# EAGLE design interface_board (EAGLE 7.5.0)

## Sheet 1 of 3
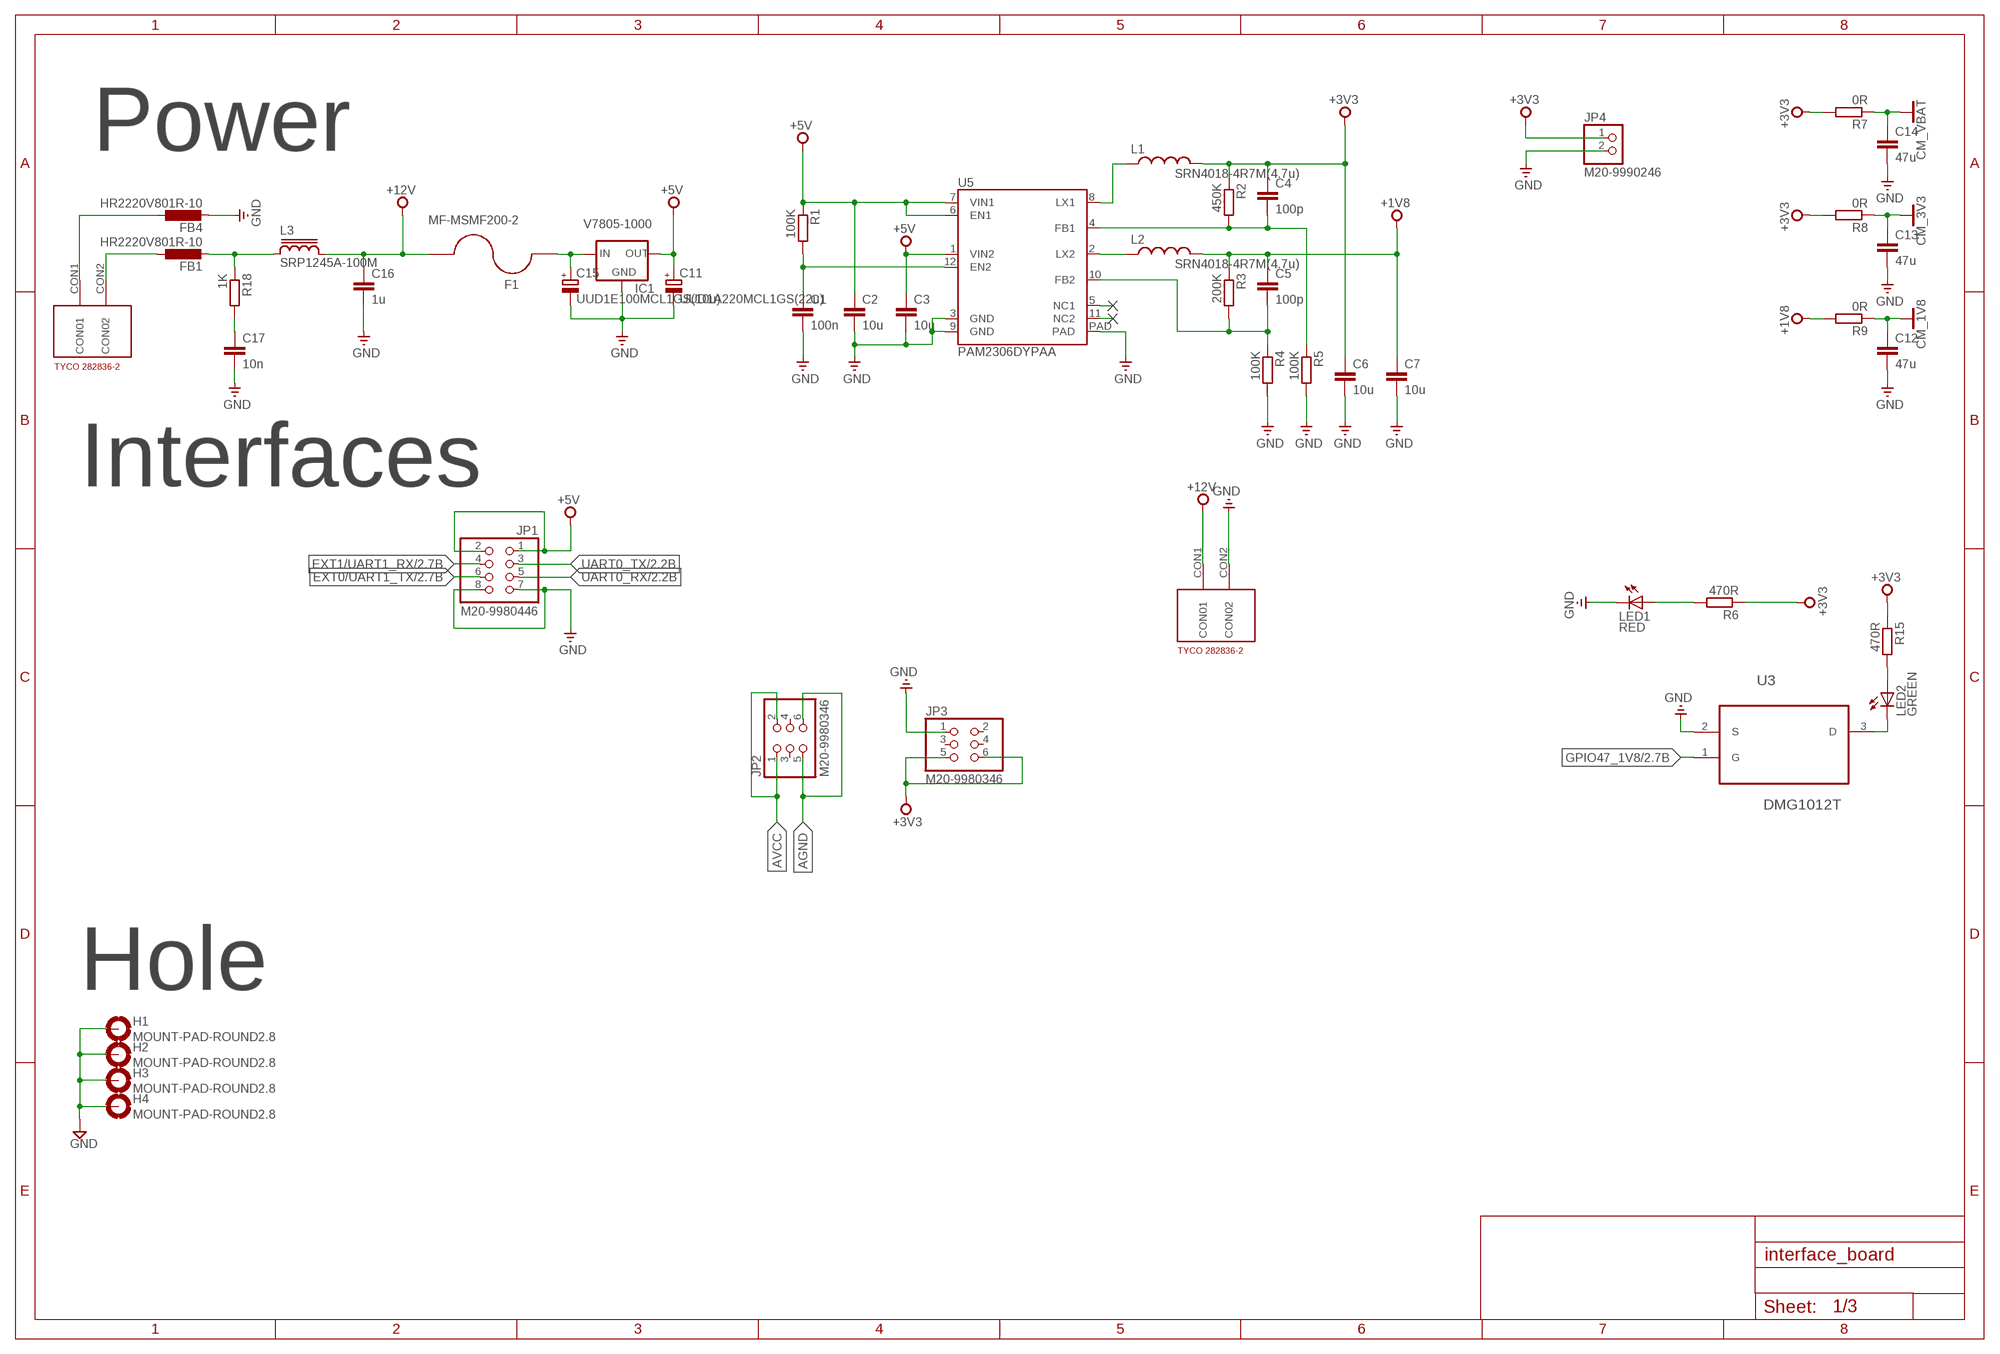
[diagram p0: schematic, sheet 1]

### Parts
C1  100n  C-EUC0402  [C0402]
C2  10u  C-EUC0805  [C0805]
C3  10u  C-EUC0805  [C0805]
C4  100p  C-EUC0402  [C0402]
C5  100p  C-EUC0402  [C0402]
C6  10u  C-EUC0805  [C0805]
C7  10u  C-EUC0805  [C0805]
C11  UUD1A220MCL1GS(22u)  CPOL-EU153CLV-0405  [153CLV-0405]
C12  47u  C-EUC1206  [C1206]
C13  47u  C-EUC1206  [C1206]
C14  47u  C-EUC1206  [C1206]
C15  UUD1E100MCL1GS(10u)  CPOL-EU153CLV-0405  [153CLV-0405]
C16  1u  C-EUC0402  [C0402]
C17  10n  C-EUC0402  [C0402]
F1  MF-MSMF200-2  MF-MSMF075/24  [1812]
FB1  HR2220V801R-10  L-EUL5650M  [L5650M]
FB4  HR2220V801R-10  L-EUL5650M  [L5650M]
H1  MOUNT-PAD-ROUND2.8  [2,8-PAD]
H2  MOUNT-PAD-ROUND2.8  [2,8-PAD]
H3  MOUNT-PAD-ROUND2.8  [2,8-PAD]
H4  MOUNT-PAD-ROUND2.8  [2,8-PAD]
IC1  V7805-1000  VR_1OUTXX  [DIP_3PIN]
JP1  M20-9980446  PINHD-2X4  [2X04]
JP2  M20-9980346  PINHD-2X3  [2X03]
JP3  M20-9980346  PINHD-2X3  [2X03]
JP4  M20-9990246  PINHD-1X2  [1X02]
L1  SRN4018-4R7M(4.7u)  BOURNS-SRN4018  [BOURNS-SRN4018]
L2  SRN4018-4R7M(4.7u)  BOURNS-SRN4018  [BOURNS-SRN4018]
L3  SRP1245A-100M  SRP1250A  [SRP1250A]
LED1  RED  LEDCHIP-LED0603  [CHIP-LED0603]
LED2  GREEN  LEDCHIP-LED0603  [CHIP-LED0603]
R1  100K  R-EU_R0402  [R0402]
R2  450K  R-EU_R0402  [R0402]
R3  200K  R-EU_R0402  [R0402]
R4  100K  R-EU_R0402  [R0402]
R5  100K  R-EU_R0402  [R0402]
R6  470R  R-EU_R0402  [R0402]
R7  0R  R-EU_R0805  [R0805]
R8  0R  R-EU_R0805  [R0805]
R9  0R  R-EU_R0805  [R0805]
R15  470R  R-EU_R0402  [R0402]
R18  1K  R-EU_R0402  [R0402]
U3  DMG1012T  [SOT523]
U5  PAM2306DYPAA  PAM2306  [WDFN3X3-12L]
U$1  282836-2  [282836-2]
U$2  M20-9980346  282836-2  [282836-2]

### Nets
+1V8: C5.1 C7.1 L2.P$1 R3.1 R9.2
+3V3: C4.1 C6.1 JP3.5 JP3.6 JP4.1 L1.P$1 R2.1 R6.1 R7.2 R8.2 R15.1 ; also sheet 2,3
+5V [VCC]: C2.1 C3.1 C11.+ IC1.OUT JP1.1 JP1.2 R1.1 U5.1(VIN2) U5.6(EN1) U5.7(VIN1) ; also sheet 3
+12V [VCC]: C16.1 F1.1 L3.2 U$2.CON1(CON01)
AGND [GND]: FB4.1 JP2.5 JP2.6 U$1.CON1(CON01)
AVCC: FB1.1 JP2.1 JP2.2 U$1.CON2(CON02)
CM_1V8: C12.1 R9.1 ; also sheet 2
CM_3V3: C13.1 R8.1 ; also sheet 2
CM_VBAT: C14.1 R7.1 ; also sheet 2
EXT0/UART1_TX: JP1.6 ; also sheet 2
EXT1/UART1_RX: JP1.4 ; also sheet 2
GND [GND]: C1.2 C2.2 C3.2 C6.2 C7.2 C11.- C12.2 C13.2 C14.2 C15.- C16.2 C17.2 FB4.2 H1.B2,8(MOUNT) H2.B2,8(MOUNT) H3.B2,8(MOUNT) H4.B2,8(MOUNT) IC1.GND JP1.7 JP1.8 JP3.1 JP4.2 LED1.C R4.2 R5.2 U3.2(S) U5.3(GND) U5.9(GND) U5.PAD U$2.CON2(CON02) ; also sheet 2,3
GPIO47_1V8: U3.1(G) ; also sheet 2
N$1: C1.1 R1.2 U5.12(EN2)
N$2: L1.P$2 U5.8(LX1)
N$3: U5.5(NC1)
N$4: U5.11(NC2)
N$6 [VCC]: FB1.2 L3.1 R18.1
N$7: L2.P$2 U5.2(LX2)
N$8: C4.2 R2.2 R5.1 U5.4(FB1)
N$9: LED1.A R6.2
N$10: C5.2 R3.2 R4.1 U5.10(FB2)
N$32: LED2.A R15.2
N$33: LED2.C U3.3(D)
N$38: C17.1 R18.2
N$39: C15.+ F1.2 IC1.IN
UART0_RX: JP1.5 ; also sheet 2
UART0_TX: JP1.3 ; also sheet 2
Unconnected: JP2.3 JP2.4 JP3.2 JP3.3 JP3.4

### Notes on the sheet
- Power
- Interfaces
- Hole

## Sheet 2 of 3
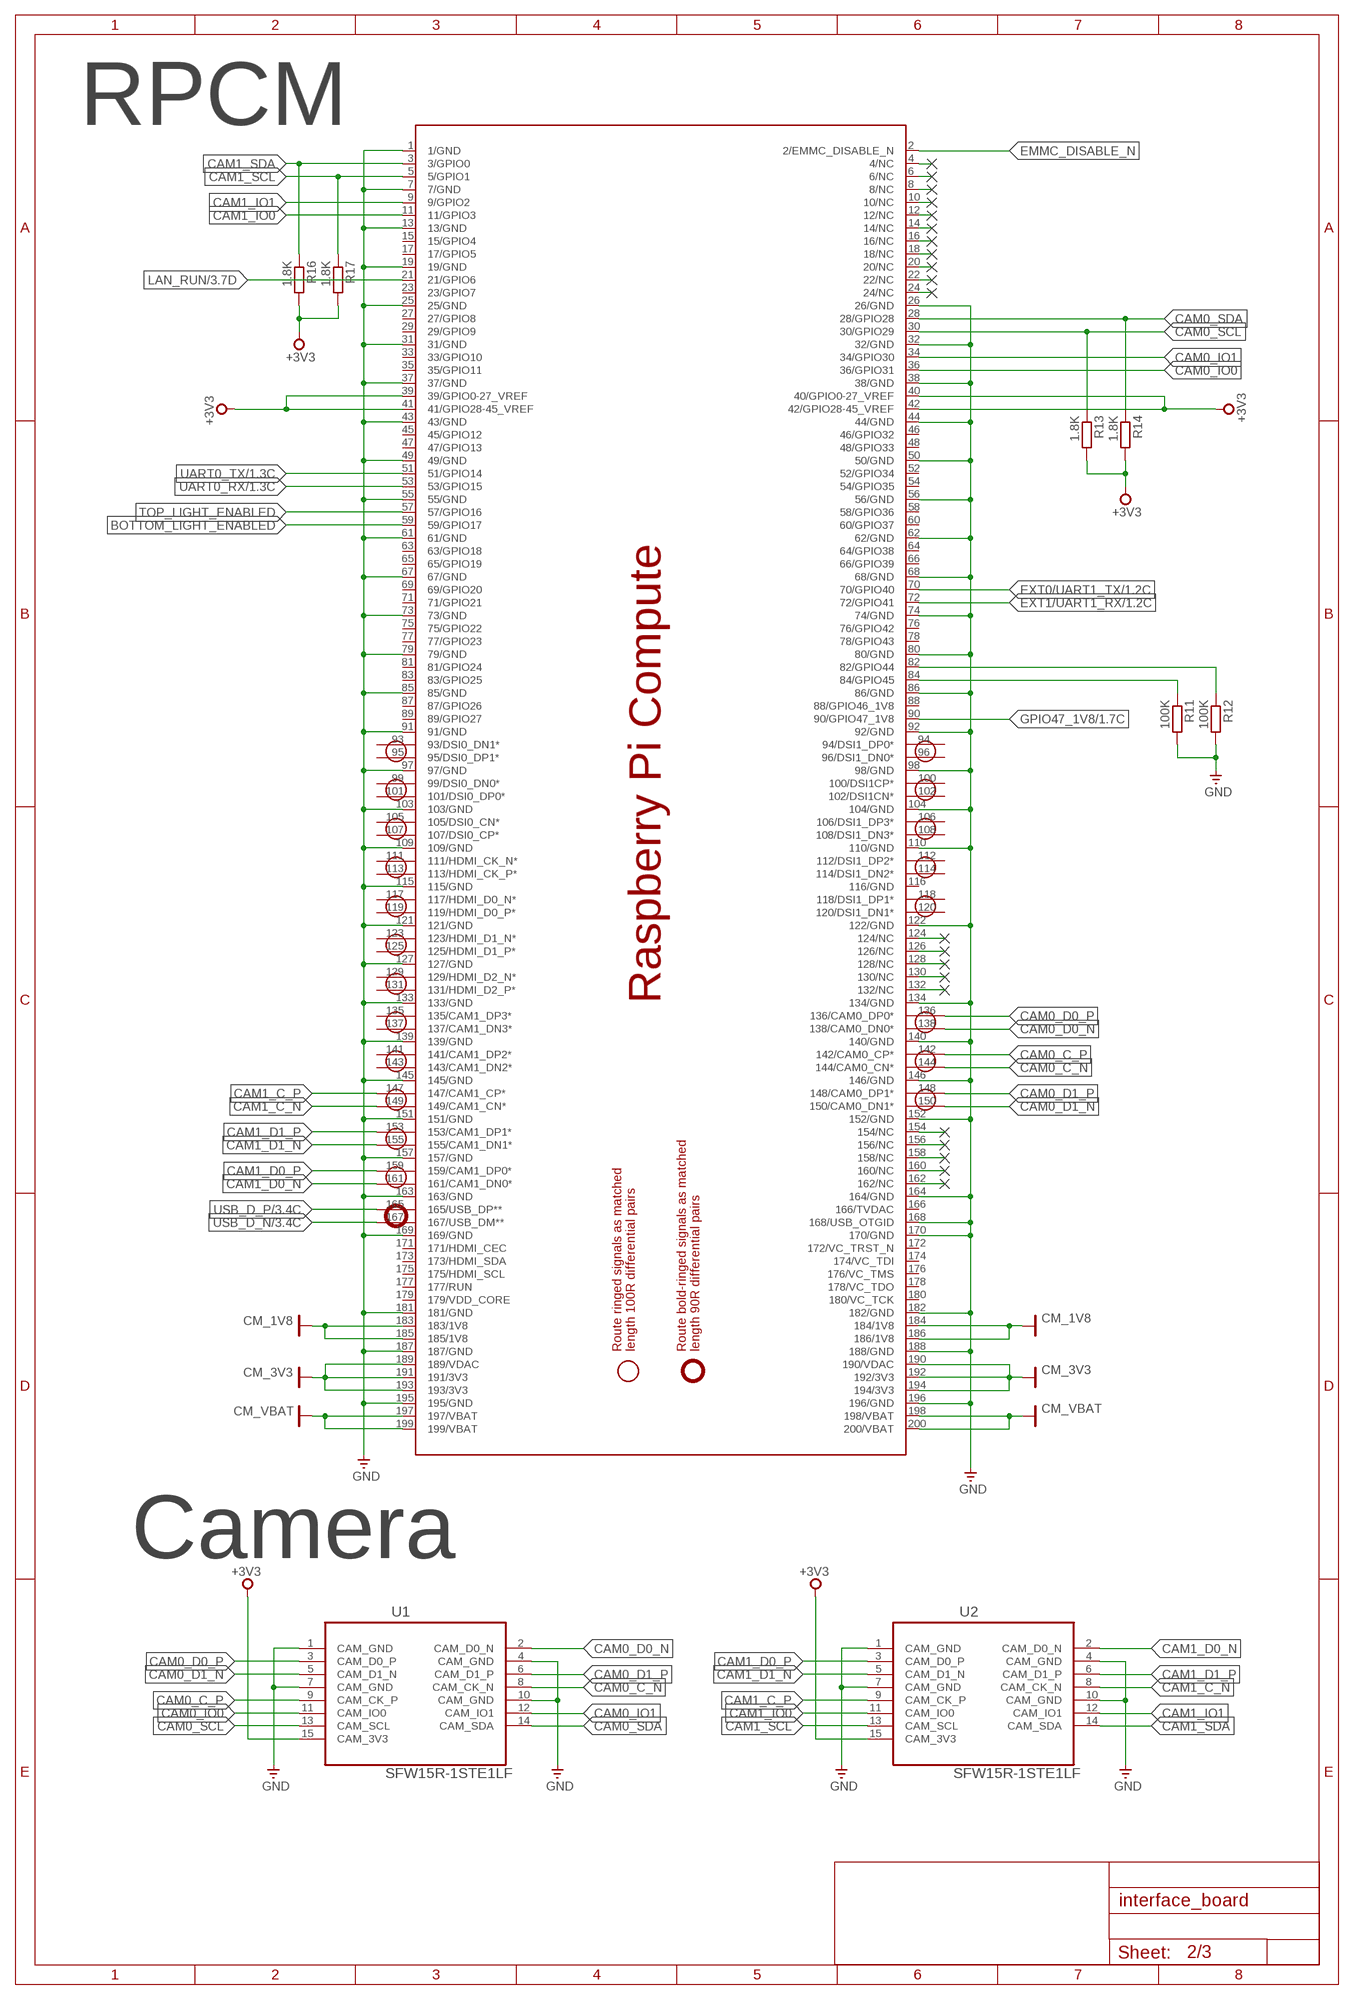
[diagram p1: schematic, sheet 2]

### Parts
PCB1  1473005-4  RPI_COMPUTE  [RPI_COMPUTE]
R11  100K  R-EU_R0402  [R0402]
R12  100K  R-EU_R0402  [R0402]
R13  1.8K  R-EU_R0402  [R0402]
R14  1.8K  R-EU_R0402  [R0402]
R16  1.8K  R-EU_R0402  [R0402]
R17  1.8K  R-EU_R0402  [R0402]
U1  SFW15R-1STE1LF  RPI_CAMERA  [RPI_CAMERA]
U2  SFW15R-1STE1LF  RPI_CAMERA  [RPI_CAMERA]

### Nets
+3V3: PCB1.39(39/GPIO0-27_VREF) PCB1.40(40/GPIO0-27_VREF) PCB1.41(41/GPIO28-45_VREF) PCB1.42(42/GPIO28-45_VREF) R13.2 R14.2 R16.2 R17.2 U1.15(CAM_3V3) U2.15(CAM_3V3) ; also sheet 1,3
BOTTOM_LIGHT_ENABLED: PCB1.59(59/GPIO17)
CAM0_C_N [100ohm_differencial_pair]: PCB1.144(144/CAM0_CN*) U1.8(CAM_CK_N)
CAM0_C_P [100ohm_differencial_pair]: PCB1.142(142/CAM0_CP*) U1.9(CAM_CK_P)
CAM0_D0_N [100ohm_differencial_pair]: PCB1.138(138/CAM0_DN0*) U1.2(CAM_D0_N)
CAM0_D0_P [100ohm_differencial_pair]: PCB1.136(136/CAM0_DP0*) U1.3(CAM_D0_P)
CAM0_D1_N [100ohm_differencial_pair]: PCB1.150(150/CAM0_DN1*) U1.5(CAM_D1_N)
CAM0_D1_P [100ohm_differencial_pair]: PCB1.148(148/CAM0_DP1*) U1.6(CAM_D1_P)
CAM0_IO0: PCB1.36(36/GPIO31) U1.11(CAM_IO0)
CAM0_IO1: PCB1.34(34/GPIO30) U1.12(CAM_IO1)
CAM0_SCL: PCB1.30(30/GPIO29) R13.1 U1.13(CAM_SCL)
CAM0_SDA: PCB1.28(28/GPIO28) R14.1 U1.14(CAM_SDA)
CAM1_C_N [100ohm_differencial_pair]: PCB1.149(149/CAM1_CN*) U2.8(CAM_CK_N)
CAM1_C_P [100ohm_differencial_pair]: PCB1.147(147/CAM1_CP*) U2.9(CAM_CK_P)
CAM1_D0_N [100ohm_differencial_pair]: PCB1.161(161/CAM1_DN0*) U2.2(CAM_D0_N)
CAM1_D0_P [100ohm_differencial_pair]: PCB1.159(159/CAM1_DP0*) U2.3(CAM_D0_P)
CAM1_D1_N [100ohm_differencial_pair]: PCB1.155(155/CAM1_DN1*) U2.5(CAM_D1_N)
CAM1_D1_P [100ohm_differencial_pair]: PCB1.153(153/CAM1_DP1*) U2.6(CAM_D1_P)
CAM1_IO0: PCB1.11(11/GPIO3) U2.11(CAM_IO0)
CAM1_IO1: PCB1.9(9/GPIO2) U2.12(CAM_IO1)
CAM1_SCL: PCB1.5(5/GPIO1) R17.1 U2.13(CAM_SCL)
CAM1_SDA: PCB1.3(3/GPIO0) R16.1 U2.14(CAM_SDA)
CM_1V8: PCB1.183(183/1V8) PCB1.184(184/1V8) PCB1.185(185/1V8) PCB1.186(186/1V8) ; also sheet 1
CM_3V3: PCB1.189(189/VDAC) PCB1.190(190/VDAC) PCB1.191(191/3V3) PCB1.192(192/3V3) PCB1.193(193/3V3) PCB1.194(194/3V3) ; also sheet 1
CM_VBAT: PCB1.197(197/VBAT) PCB1.198(198/VBAT) PCB1.199(199/VBAT) PCB1.200(200/VBAT) ; also sheet 1
EMMC_DISABLE_N: PCB1.2(2/EMMC_DISABLE_N)
EXT0/UART1_TX: PCB1.70(70/GPIO40) ; also sheet 1
EXT1/UART1_RX: PCB1.72(72/GPIO41) ; also sheet 1
GND [GND]: PCB1.1(1/GND) PCB1.7(7/GND) PCB1.13(13/GND) PCB1.19(19/GND) PCB1.25(25/GND) PCB1.26(26/GND) PCB1.31(31/GND) PCB1.32(32/GND) PCB1.37(37/GND) PCB1.38(38/GND) PCB1.43(43/GND) PCB1.44(44/GND) PCB1.49(49/GND) PCB1.50(50/GND) PCB1.55(55/GND) PCB1.56(56/GND) PCB1.61(61/GND) PCB1.62(62/GND) PCB1.67(67/GND) PCB1.68(68/GND) PCB1.73(73/GND) PCB1.74(74/GND) PCB1.79(79/GND) PCB1.80(80/GND) PCB1.85(85/GND) PCB1.86(86/GND) PCB1.91(91/GND) PCB1.92(92/GND) PCB1.97(97/GND) PCB1.98(98/GND) PCB1.103(103/GND) PCB1.104(104/GND) PCB1.109(109/GND) PCB1.110(110/GND) PCB1.115(115/GND) PCB1.121(121/GND) PCB1.122(122/GND) PCB1.127(127/GND) PCB1.133(133/GND) PCB1.134(134/GND) PCB1.139(139/GND) PCB1.140(140/GND) PCB1.145(145/GND) PCB1.146(146/GND) PCB1.151(151/GND) PCB1.152(152/GND) PCB1.157(157/GND) PCB1.163(163/GND) PCB1.164(164/GND) PCB1.168(168/USB_OTGID) PCB1.169(169/GND) PCB1.170(170/GND) PCB1.181(181/GND) PCB1.182(182/GND) PCB1.187(187/GND) PCB1.188(188/GND) PCB1.195(195/GND) PCB1.196(196/GND) R11.2 R12.2 U1.1(CAM_GND) U1.4(CAM_GND) U1.7(CAM_GND) U1.10(CAM_GND) U2.1(CAM_GND) U2.4(CAM_GND) U2.7(CAM_GND) U2.10(CAM_GND) ; also sheet 1,3
GPIO47_1V8: PCB1.90(90/GPIO47_1V8) ; also sheet 1
LAN_RUN: PCB1.21(21/GPIO6) ; also sheet 3
N$11: PCB1.154(154/NC)
N$12: PCB1.156(156/NC)
N$13: PCB1.158(158/NC)
N$14: PCB1.160(160/NC)
N$15: PCB1.162(162/NC)
N$16: PCB1.10(10/NC)
N$17: PCB1.12(12/NC)
N$18: PCB1.14(14/NC)
N$19: PCB1.16(16/NC)
N$20: PCB1.18(18/NC)
N$21: PCB1.20(20/NC)
N$22: PCB1.22(22/NC)
N$23: PCB1.24(24/NC)
N$24: PCB1.124(124/NC)
N$25: PCB1.126(126/NC)
N$26: PCB1.128(128/NC)
N$27: PCB1.130(130/NC)
N$28: PCB1.132(132/NC)
N$29: PCB1.4(4/NC)
N$30: PCB1.6(6/NC)
N$31: PCB1.82(82/GPIO44) R12.1
N$34: PCB1.84(84/GPIO45) R11.1
N$35: PCB1.8(8/NC)
TOP_LIGHT_ENABLED: PCB1.57(57/GPIO16)
UART0_RX: PCB1.53(53/GPIO15) ; also sheet 1
UART0_TX: PCB1.51(51/GPIO14) ; also sheet 1
USB_D_N [90ohm_differencial_pair]: PCB1.167(167/USB_DM**) ; also sheet 3
USB_D_P [90ohm_differencial_pair]: PCB1.165(165/USB_DP**) ; also sheet 3
Unconnected: PCB1.15(15/GPIO4) PCB1.17(17/GPIO5) PCB1.23(23/GPIO7) PCB1.27(27/GPIO8) PCB1.29(29/GPIO9) PCB1.33(33/GPIO10) PCB1.35(35/GPIO11) PCB1.45(45/GPIO12) PCB1.46(46/GPIO32) PCB1.47(47/GPIO13) PCB1.48(48/GPIO33) PCB1.52(52/GPIO34) PCB1.54(54/GPIO35) PCB1.58(58/GPIO36) PCB1.60(60/GPIO37) PCB1.63(63/GPIO18) PCB1.64(64/GPIO38) PCB1.65(65/GPIO19) PCB1.66(66/GPIO39) PCB1.69(69/GPIO20) PCB1.71(71/GPIO21) PCB1.75(75/GPIO22) PCB1.76(76/GPIO42) PCB1.77(77/GPIO23) PCB1.78(78/GPIO43) PCB1.81(81/GPIO24) PCB1.83(83/GPIO25) PCB1.87(87/GPIO26) PCB1.88(88/GPIO46_1V8) PCB1.89(89/GPIO27) PCB1.93(93/DSI0_DN1*) PCB1.94(94/DSI1_DP0*) PCB1.95(95/DSI0_DP1*) PCB1.96(96/DSI1_DN0*) PCB1.99(99/DSI0_DN0*) PCB1.100(100/DSI1CP*) PCB1.101(101/DSI0_DP0*) PCB1.102(102/DSI1CN*) PCB1.105(105/DSI0_CN*) PCB1.106(106/DSI1_DP3*) PCB1.107(107/DSI0_CP*) PCB1.108(108/DSI1_DN3*) PCB1.111(111/HDMI_CK_N*) PCB1.112(112/DSI1_DP2*) PCB1.113(113/HDMI_CK_P*) PCB1.114(114/DSI1_DN2*) PCB1.116(116/GND) PCB1.117(117/HDMI_D0_N*) PCB1.118(118/DSI1_DP1*) PCB1.119(119/HDMI_D0_P*) PCB1.120(120/DSI1_DN1*) PCB1.123(123/HDMI_D1_N*) PCB1.125(125/HDMI_D1_P*) PCB1.129(129/HDMI_D2_N*) PCB1.131(131/HDMI_D2_P*) PCB1.135(135/CAM1_DP3*) PCB1.137(137/CAM1_DN3*) PCB1.141(141/CAM1_DP2*) PCB1.143(143/CAM1_DN2*) PCB1.166(166/TVDAC) PCB1.171(171/HDMI_CEC) PCB1.172(172/VC_TRST_N) PCB1.173(173/HDMI_SDA) PCB1.174(174/VC_TDI) PCB1.175(175/HDMI_SCL) PCB1.176(176/VC_TMS) PCB1.177(177/RUN) PCB1.178(178/VC_TDO) PCB1.179(179/VDD_CORE) PCB1.180(180/VC_TCK)

### Notes on the sheet
- RPCM
- Camera

## Sheet 3 of 3
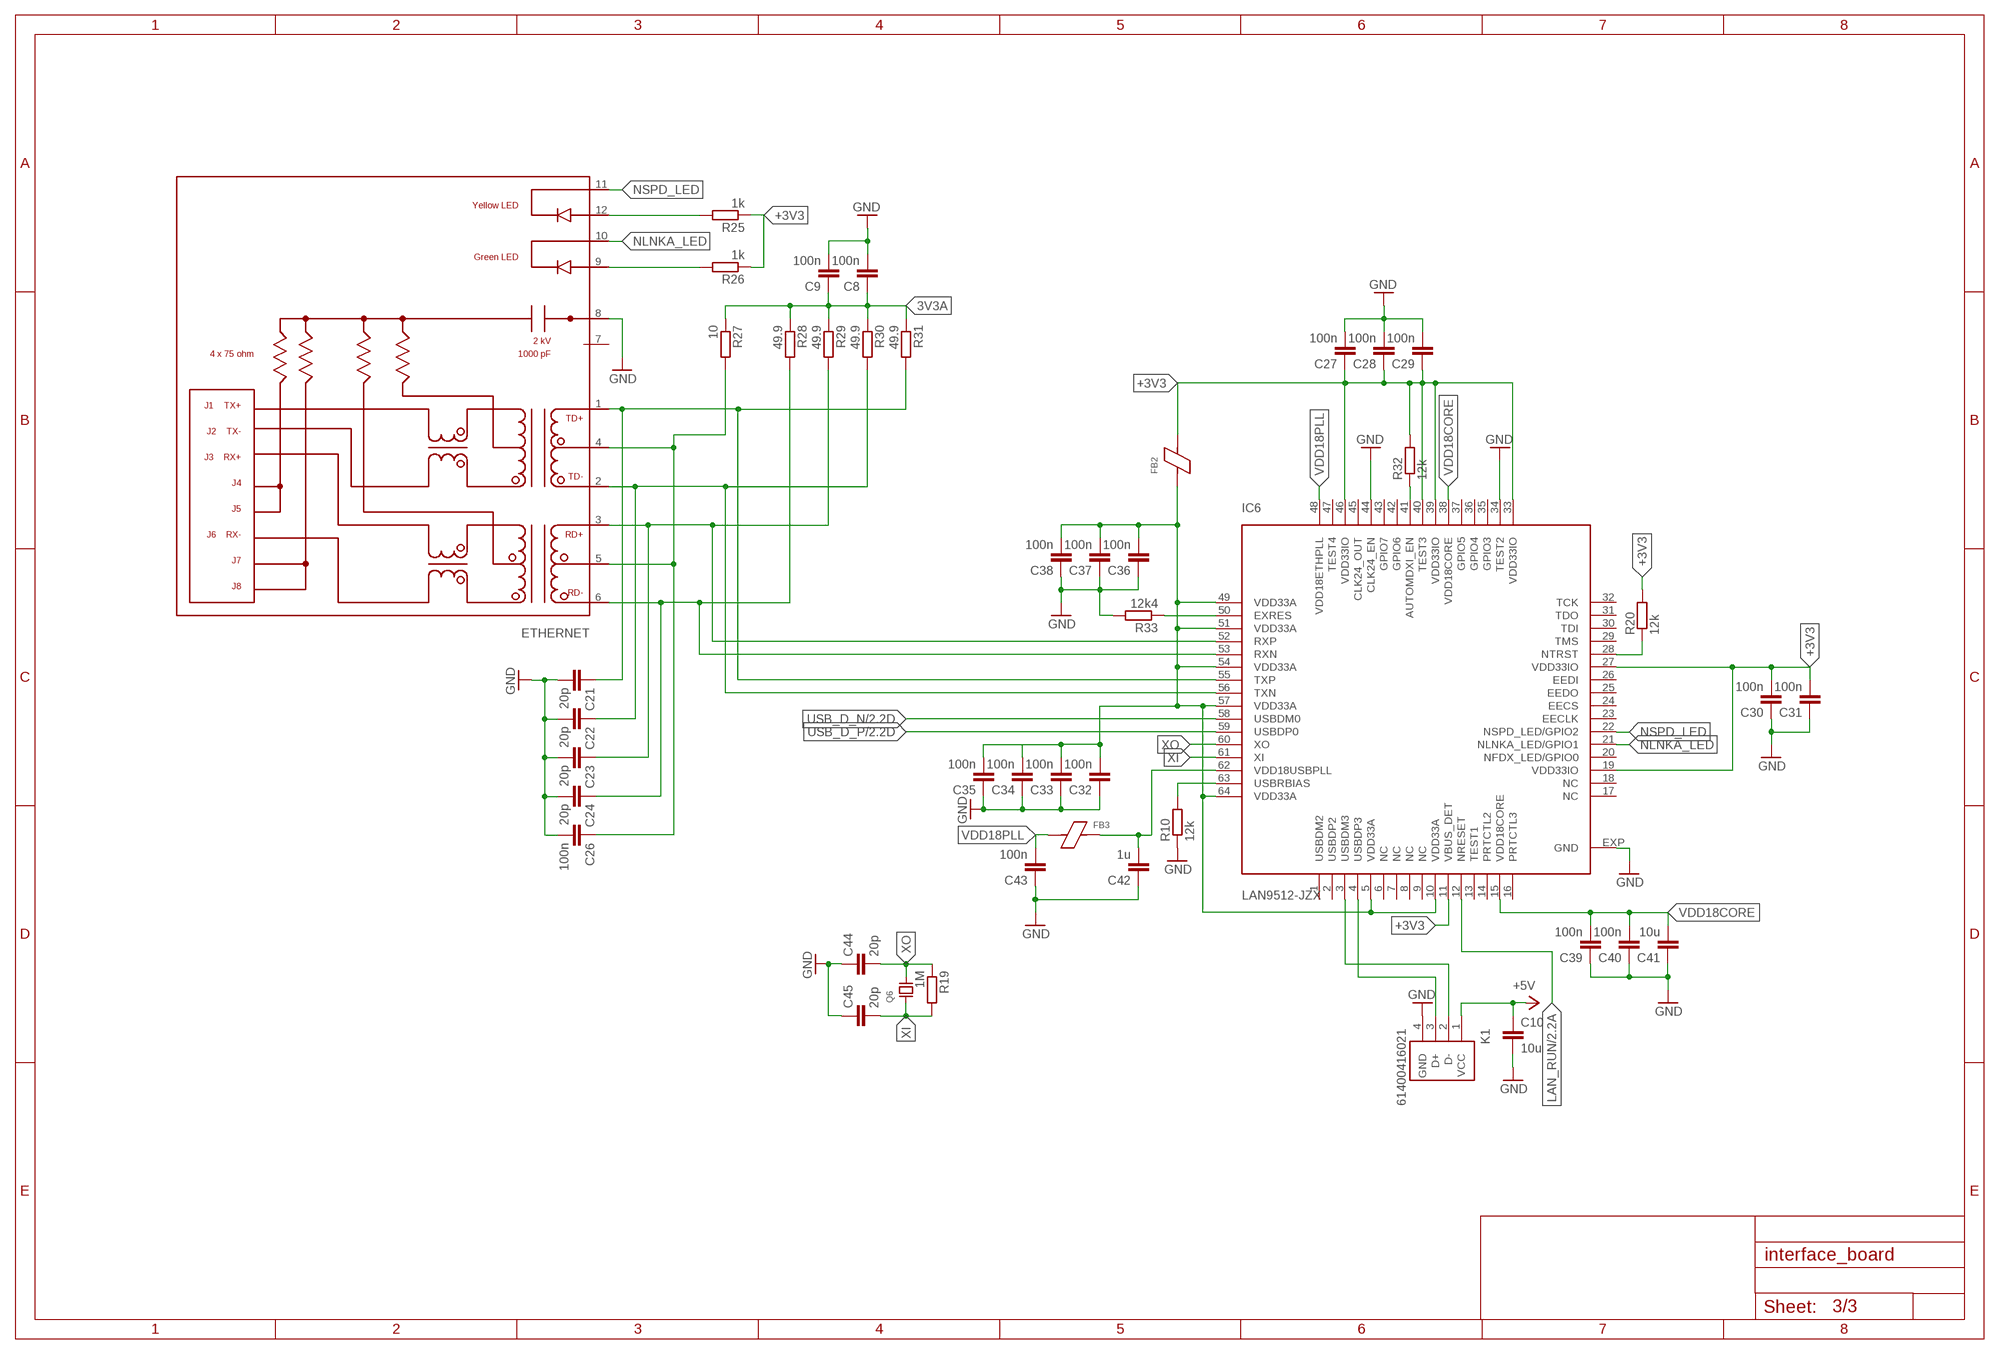
[diagram p2: schematic, sheet 3]

### Parts
C8  100n  C-EUC0603  [C0603]
C9  100n  C-EUC0603  [C0603]
C10  10u  C-EUC0805  [C0805]
C21  20p  C-EUC0603  [C0603]
C22  20p  C-EUC0603  [C0603]
C23  20p  C-EUC0603  [C0603]
C24  20p  C-EUC0603  [C0603]
C26  100n  C-EUC0603  [C0603]
C27  100n  C-EUC0603  [C0603]
C28  100n  C-EUC0603  [C0603]
C29  100n  C-EUC0603  [C0603]
C30  100n  C-EUC0603  [C0603]
C31  100n  C-EUC0603  [C0603]
C32  100n  C-EUC0603  [C0603]
C33  100n  C-EUC0603  [C0603]
C34  100n  C-EUC0603  [C0603]
C35  100n  C-EUC0603  [C0603]
C36  100n  C-EUC0603  [C0603]
C37  100n  C-EUC0603  [C0603]
C38  100n  C-EUC0603  [C0603]
C39  100n  C-EUC0603  [C0603]
C40  100n  C-EUC0603  [C0603]
C41  10u  C-EUC0805  [C0805]
C42  1u  C-EUC0805  [C0805]
C43  100n  C-EUC0603  [C0603]
C44  20p  C-EUC0603  [C0603]
C45  20p  C-EUC0603  [C0603]
ETHERNET  HR911105A  [RJ45]
FB2  742792022  FERRITE_BEAD  [C0805]
FB3  742792022  FERRITE_BEAD  [C0805]
IC6  LAN9512-JZX  LAN9512  [QFN64-9X9]
K1  61400416021  [61400416021]
Q6  CTS_32X25_SMD  [CTS_32X25]
R10  12k  R-EU_R0603  [R0603]
R19  1M  R-EU_R0603  [R0603]
R20  12k  R-EU_R0603  [R0603]
R25  1k  R-EU_R0603  [R0603]
R26  1k  R-EU_R0603  [R0603]
R27  10  R-EU_R0603  [R0603]
R28  49.9  R-EU_R0603  [R0603]
R29  49.9  R-EU_R0603  [R0603]
R30  49.9  R-EU_R0603  [R0603]
R31  49.9  R-EU_R0603  [R0603]
R32  12k  R-EU_R0603  [R0603]
R33  12k4  R-EU_R0603  [R0603]

### Nets
3V3A: C8.1 C9.1 R27.1 R28.1 R29.1 R30.1 R31.1
3V3A1: C32.2 C33.2 C34.2 C35.2 C36.2 C37.2 C38.2 FB2.1 IC6.5(VDD33A) IC6.10(VDD33A) IC6.49(VDD33A) IC6.51(VDD33A) IC6.54(VDD33A) IC6.57(VDD33A) IC6.64(VDD33A)
+3V3: C27.1 C28.1 C29.1 C30.2 C31.2 FB2.2 IC6.11(VBUS_DET) IC6.19(VDD33IO) IC6.27(VDD33IO) IC6.33(VDD33IO) IC6.39(VDD33IO) IC6.40(TEST3) IC6.46(VDD33IO) R20.2 R25.1 R26.1 R32.2 ; also sheet 1,2
+5V [VCC]: C10.1 K1.1(VCC) ; also sheet 1
GND [GND]: C8.2 C9.2 C10.2 C21.2 C22.2 C23.2 C24.2 C26.2 C27.2 C28.2 C29.2 C30.1 C31.1 C32.1 C33.1 C34.1 C35.1 C36.1 C37.1 C38.1 C39.1 C40.1 C41.1 C42.1 C43.1 C44.1 C45.1 ETHERNET.8 IC6.34(TEST2) IC6.44(CLK24_EN) IC6.EXP(GND) K1.4(GND) R10.1 R33.2 ; also sheet 1,2
LAN_RUN: IC6.12(NRESET) ; also sheet 2
N$37: ETHERNET.12 R25.2
N$40: ETHERNET.9 R26.2
N$41: C26.1 ETHERNET.4 ETHERNET.5 R27.2
N$42: IC6.63(USBRBIAS) R10.2
N$43: C42.2 FB3.2 IC6.62(VDD18USBPLL)
N$44: IC6.41(AUTOMDXI_EN) R32.1
N$45: IC6.50(EXRES) R33.1
N$46: IC6.28(NTRST) R20.1
NLNKA_LED: ETHERNET.10 IC6.21(NLNKA_LED/GPIO1)
NSPD_LED: ETHERNET.11 IC6.22(NSPD_LED/GPIO2)
RX_N [100ohm_differencial_pair]: C24.1 ETHERNET.6 IC6.53(RXN) R28.2
RX_P [100ohm_differencial_pair]: C23.1 ETHERNET.3 IC6.52(RXP) R29.2
TX_N [100ohm_differencial_pair]: C22.1 ETHERNET.2 IC6.56(TXN) R30.2
TX_P [100ohm_differencial_pair]: C21.1 ETHERNET.1 IC6.55(TXP) R31.2
USB_D_N [90ohm_differencial_pair]: IC6.58(USBDM0) ; also sheet 2
USB_D_P [90ohm_differencial_pair]: IC6.59(USBDP0) ; also sheet 2
USBD3_N [90ohm_differencial_pair]: IC6.3(USBDM3) K1.2(D-)
USBD3_P [90ohm_differencial_pair]: IC6.4(USBDP3) K1.3(D+)
VDD18CORE: C39.2 C40.2 C41.2 IC6.15(VDD18CORE) IC6.38(VDD18CORE)
VDD18PLL: C43.2 FB3.1 IC6.48(VDD18ETHPLL)
XI: C45.2 IC6.61(XI) Q6.1(X1) R19.2
XO: C44.2 IC6.60(XO) Q6.3(X2) R19.1
Unconnected: ETHERNET.7 IC6.1(USBDM2) IC6.2(USBDP2) IC6.6(NC) IC6.7(NC) IC6.8(NC) IC6.9(NC) IC6.13(TEST1) IC6.14(PRTCTL2) IC6.16(PRTCTL3) IC6.17(NC) IC6.18(NC) IC6.20(NFDX_LED/GPIO0) IC6.23(EECLK) IC6.24(EECS) IC6.25(EEDO) IC6.26(EEDI) IC6.29(TMS) IC6.30(TDI) IC6.31(TDO) IC6.32(TCK) IC6.35(GPIO3) IC6.36(GPIO4) IC6.37(GPIO5) IC6.42(GPIO6) IC6.43(GPIO7) IC6.45(CLK24_OUT) IC6.47(TEST4)

## Library data of the parts
C1-C7 C12-C14 C16 C17 = resistor:C-EU: CAPACITOR, European symbol
C8-C10 C21-C24 C26-C45 = rcl:C-EU: CAPACITOR, European symbol
C11 C15 = resistor:CPOL-EU: POLARIZED CAPACITOR, European symbol
ETHERNET = hanrun:HR911105A: Low cost RJ45 connector with integrated magnetics and LEDs. www.hasseb.fi
F1 = openblw:MF-MSMF*?: PTC Resettable Fuse Documentation Datasheet <http://www.bourns.com/data/global/pdfs/mfmsmf.pdf> Features Compliant with AEC-Q200 Rev-C- Stress Test Qualification for Passive Components in Automotive Applications 100% electrically compatible with all previous generations of 1812 SMT devices Compatible with Pb and Pb-free solder reflow profiles RoHS compliant* and halogen free** Surface mount packaging for automated assembly Standard 4532 mm (1812 mils) footprint Patents pending; CATEGORY: Circuit Protection; CURRENT-MAX: 40A; CURRENT-TRIP: 1.5A; DESCRIPTION: PTC RESETTABLE .75A 24V 1812; DOCUMENTATION_LINK: <a href="http://www.bourns.com/data/global/pdfs/mfmsmf.pdf">Datasheet</a>; DOCUMENTATION_URL: http://www.bourns.com/data/global/pdfs/mfmsmf.pdf; FAMILY: PTC Resettable Fuses; MANUFACTURER: Bourns Inc.; PACKAGE: 1812 (4532 Metric), Concave; PART_NUMBER: MF-MSMF075/24-2; R_MINMAX: 0.11 ~ 0.450 Ohm; SERIES: MF-MSMF; SUPPLIER_ITEM_LINK: <a href="http://www.digikey.com/product-detail/en/MF-MSMF075%2F24-2/MF-MSMF075%2F24-2CT-ND/662844">Details</a>; SUPPLIER_ITEM_NUMBER: MF-MSMF075/24-2CT-ND; SUPPLIER_ITEM_URL: http://www.digikey.com/product-detail/en/MF-MSMF075%2F24-2/MF-MSMF075%2F24-2CT-ND/662844; SUPPLIER_LINK: <a href="http://www.digikey.com">Home Page</a>; SUPPLIER_NAME: Digi-Key; SUPPLIER_URL: http://www.digikey.com; TIME_TO_TRIP: 0.2s; VOLTAGE-MAX: 24V
FB1 FB4 = resistor:L-EU: INDUCTOR, European symbol
FB2 FB3 = raspi:FERRITE_BEAD
H1-H4 = holes:MOUNT-PAD-ROUND: MOUNTING PAD, round
IC1 = openblw:VR_1OUT: VOLTAGE REGULATOR
IC6 = raspi:LAN9512
JP1 = pinhead:PINHD-2X4: PIN HEADER
JP2 JP3 = pinhead:PINHD-2X3: PIN HEADER
JP4 = openblw:PINHD-1X2: PIN HEADER
K1 = openblw:61400416021: WR-COM Horizontal USB Type A
L1 L2 = openblw:BOURNS-SRN4018
L3 = openblw:SRP1250A: POWER INDUCTOR
LED1 LED2 = led:LED: LED OSRAM: - CHIPLED LG R971, LG N971, LY N971, LG Q971, LY Q971, LO R971, LY R971 LH N974, LH R974 LS Q976, LO Q976, LY Q976 LO Q996 - Hyper CHIPLED LW Q18S LB Q993, LB Q99A, LB R99A - SideLED LS A670, LO A670, LY A670, LG A670, LP A670 LB A673, LV A673, LT A673, LW A673 LH A674 LY A675 LS A676, LA A676, LO A676, LY A676, LW A676 LS A679, LY A679, LG A679 - Hyper Micro SIDELED® LS Y876, LA Y876, LO Y876, LY Y876 LT Y87S - SmartLED LW L88C, LW L88S LB L89C, LB L89S, LG L890 LS L89K, LO L89K, LY L89K LS L896, LA L896, LO L896, LY L896 - TOPLED LS T670, LO T670, LY T670, LG T670, LP T670 LSG T670, LSP T670, LSY T670, LOP T670, LYG T670 LG T671, LOG T671, LSG T671 LB T673, LV T673, LT T673, LW T673 LH T674 LS T676, LA T676, LO T676, LY T676, LB T676, LH T676, LSB T676, LW T676 LB T67C, LV T67C, LT T67C, LS T67K, LO T67K, LY T67K, LW E67C LS E67B, LA E67B, LO E67B, LY E67B, LB E67C, LV E67C, LT E67C LW T67C LS T679, LY T679, LG T679 LS T770, LO T770, LY T770, LG T770, LP T770 LB T773, LV T773, LT T773, LW T773 LH T774 LS E675, LA E675, LY E675, LS T675 LS T776, LA T776, LO T776, LY T776, LB T776 LHGB T686 LT T68C, LB T68C - Hyper Mini TOPLED® LB M676 - Mini TOPLED Santana® LG M470 LS M47K, LO M47K, LY M47K Source: http://www.osram.convergy.de LUXEON: - LUMILED® LXK2-PW12-R00, LXK2-PW12-S00, LXK2-PW14-U00, LXK2-PW14-V00 LXK2-PM12-R00, LXK2-PM12-S00, LXK2-PM14-U00 LXK2-PE12-Q00, LXK2-PE12-R00, LXK2-PE12-S00, LXK2-PE14-T00, LXK2-PE14-U00 LXK2-PB12-K00, LXK2-PB12-L00, LXK2-PB12-M00, LXK2-PB14-N00, LXK2-PB14-P00, LXK2-PB14-Q00 LXK2-PR12-L00, LXK2-PR12-M00, LXK2-PR14-Q00, LXK2-PR14-R00 LXK2-PD12-Q00, LXK2-PD12-R00, LXK2-PD12-S00 LXK2-PH12-R00, LXK2-PH12-S00 LXK2-PL12-P00, LXK2-PL12-Q00, LXK2-PL12-R00 Source: www.luxeon.com KINGBRIGHT: KA-3528ASYC Source: www.kingbright.com
PCB1 = openblw:RPI_COMPUTE: Device for a Raspberry PI Compute module. Note that the package is for a DDR2 connector of 'standard' orientation. Example: TE Connectivity P/N: 1565917-4, Newark P/N: 08P0616, Farnell P/N: 2112525 More information is available at http://www.element14.com/community/community/raspberry-pi/raspberry-pi-compute-module
Q6 = raspi:CTS_32X25_SMD
R1-R9 R11-R18 = resistor:R-EU_: RESISTOR, European symbol
R10 R19 R20 R25-R33 = rcl:R-EU_: RESISTOR, European symbol
U1 U2 = openblw:RPI_CAMERA: FFC/FPC CONNECTOR, RECEPTACLE 16POS 1ROW; MPN: SFW16R-1STE1LF; OC_FARNELL: 1835594; OC_NEWARK: 62K5606; PACKAGE: CONNECTOR- 16POS; SUPPLIER: FCI
U3 = openblw:DMG1012T
U5 = openblw:PAM2306
U$1 U$2 = openblw:282836-2: TYCO 282836-2 TERM BLOCK 2POS SIDE ENTRY 5MM EURISTYLE

## Net classes
1 GND: width 0.508 mm, drill 0.3 mm, clearance 0.2 mm to class 0, clearance 0.2 mm
2 100ohm_differencial_pair: width 0.254 mm, drill 0.3 mm, clearance 0.5 mm to class 0, clearance 0.5 mm to class 1, clearance 0.25 mm
3 90ohm_differencial_pair: width 0.254 mm, drill 0.3 mm, clearance 0.5 mm to class 0, clearance 0.5 mm to class 1, clearance 0.5 mm to class 2, clearance 0.15 mm
4 AGND: width 0.508 mm, drill 0.3 mm, clearance 0.5 mm to class 0, clearance 0.5 mm to class 1, clearance 0.5 mm to class 2, clearance 0.5 mm to class 3, clearance 0.15 mm
5 VCC: width 0.508 mm, drill 0.3 mm, clearance 0.3 mm to class 0, clearance 0.3 mm to class 1, clearance 0.5 mm to class 2, clearance 0.5 mm to class 3, clearance 0.5 mm to class 4, clearance 0.3 mm

## Board
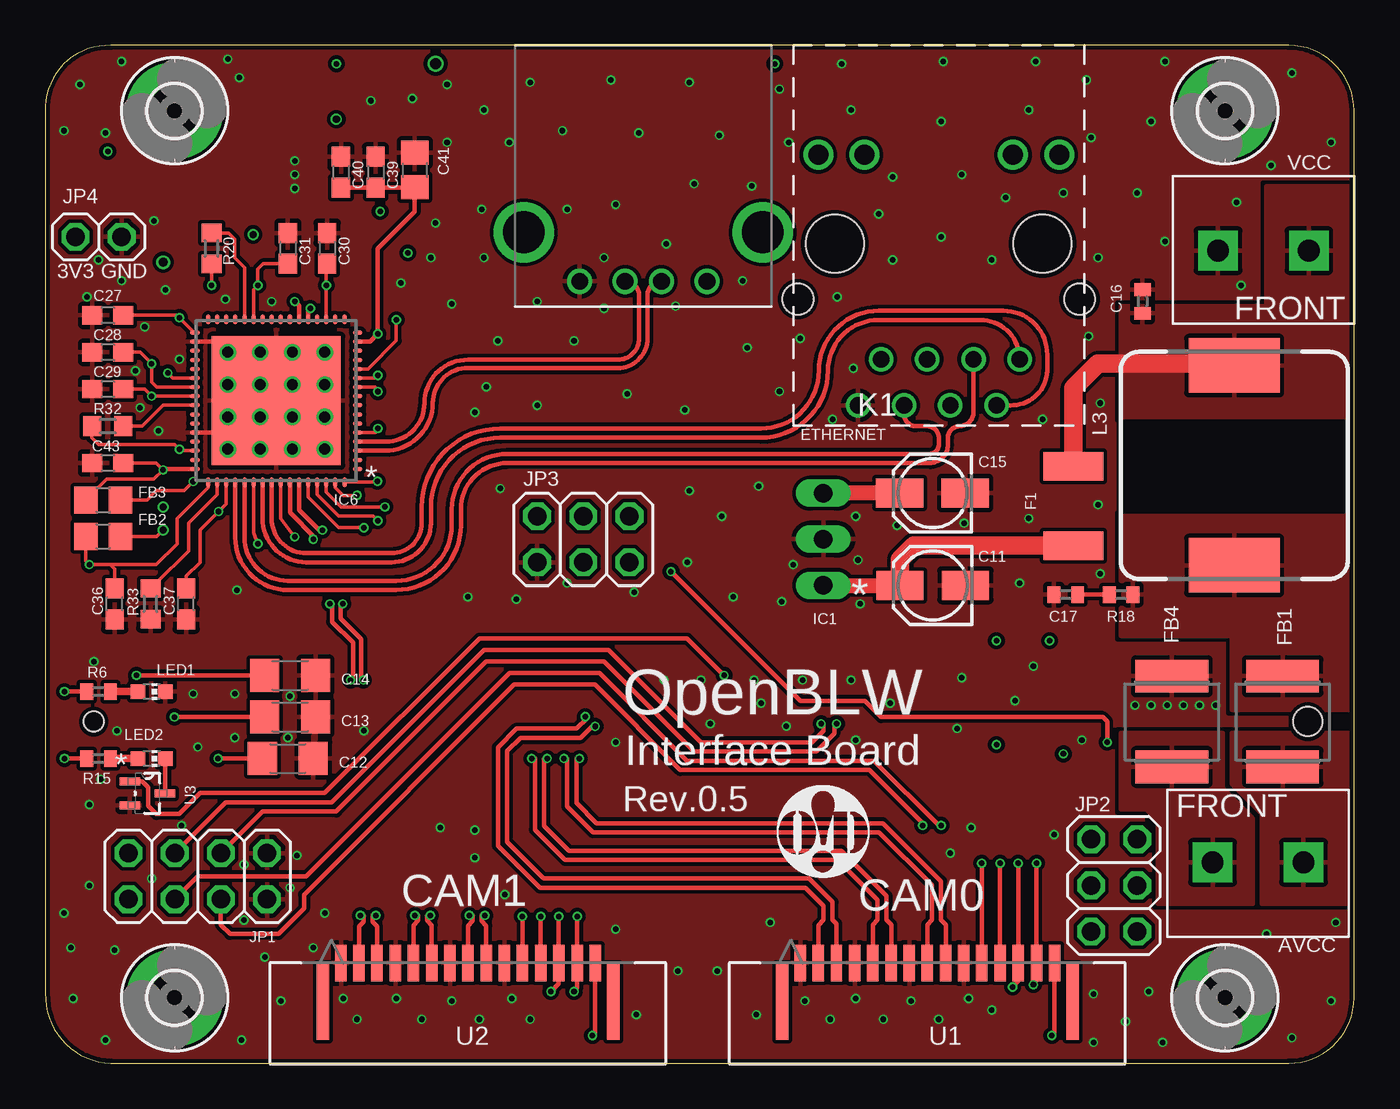
[diagram p3: board, top side]
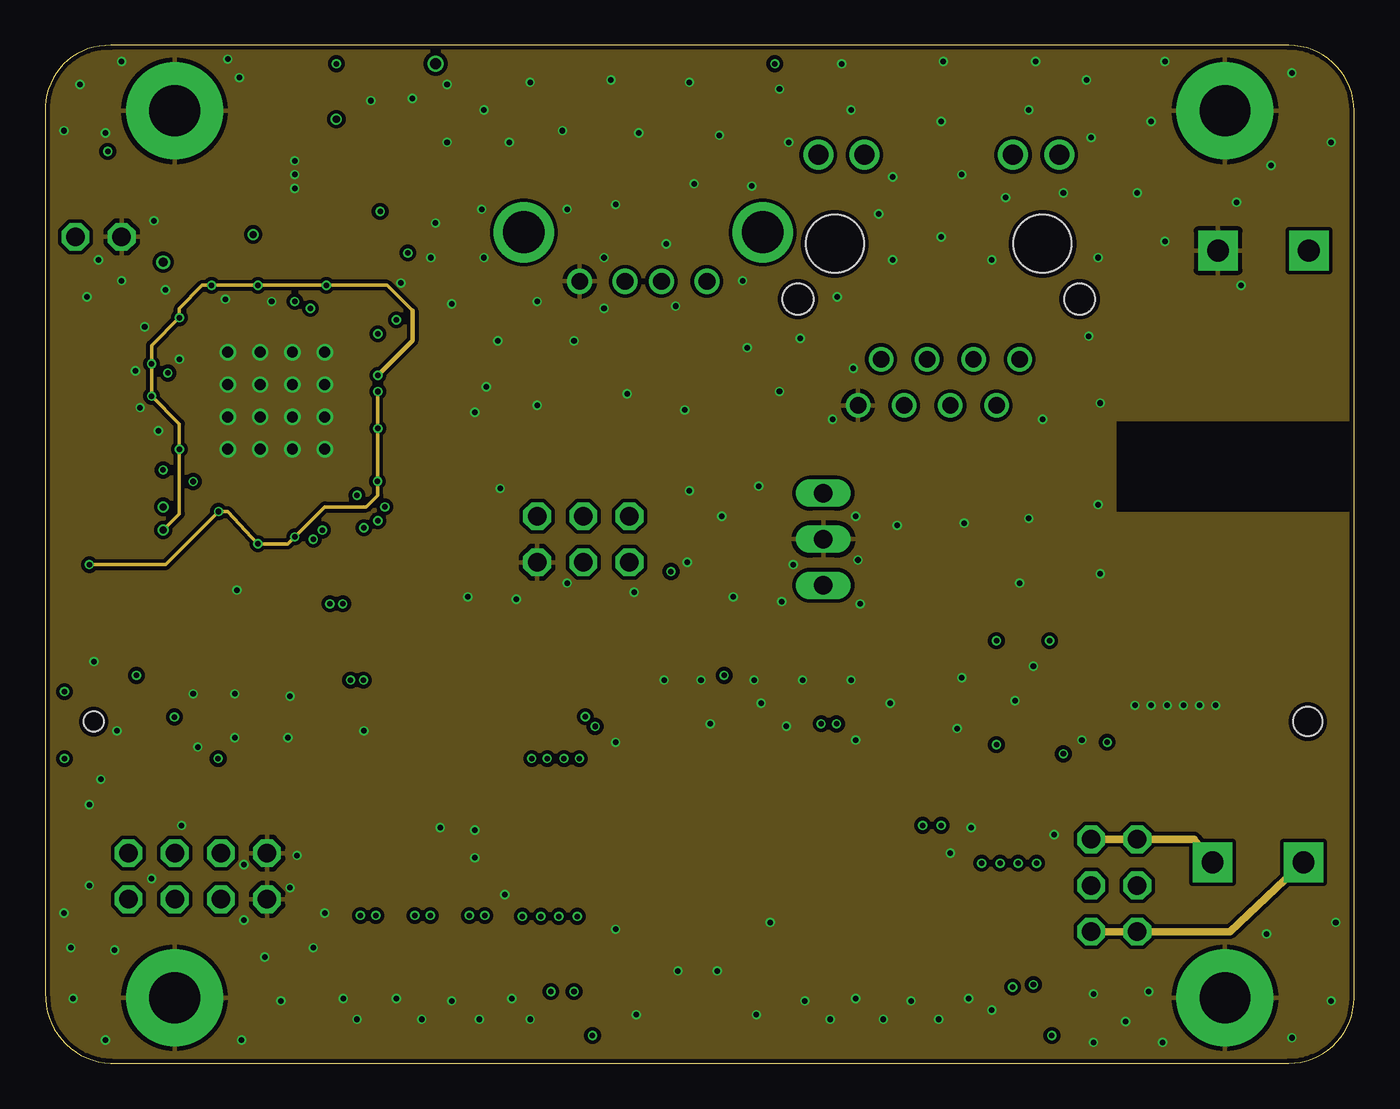
[diagram p4: board, inner layer Route2]
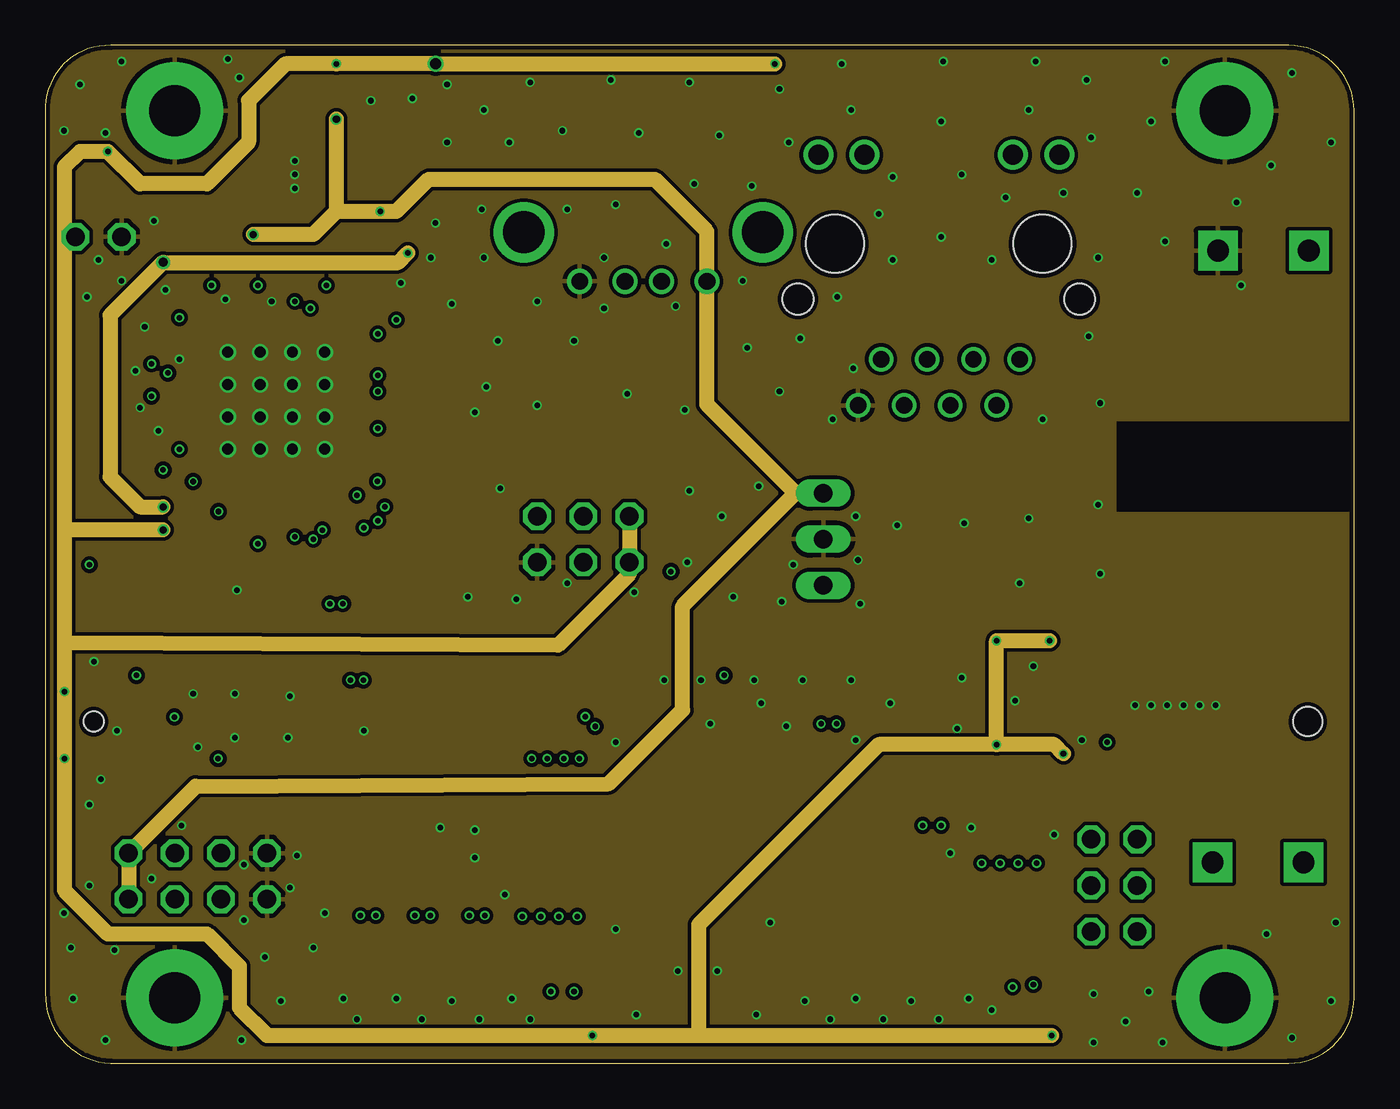
[diagram p5: board, inner layer Route15]
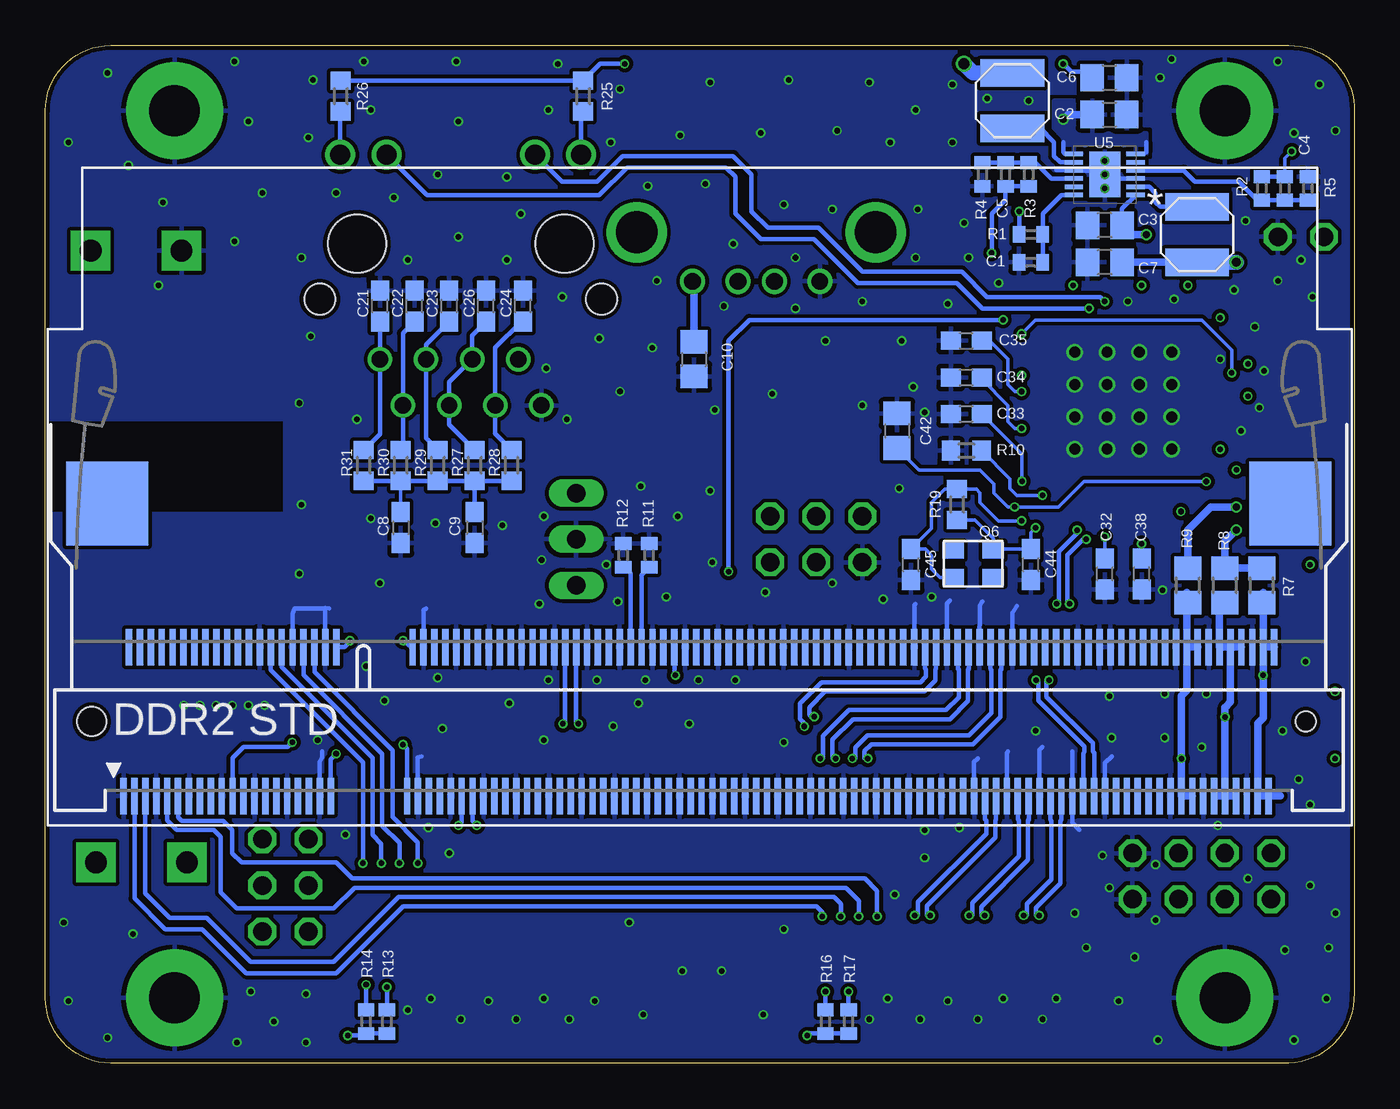
[diagram p6: board, bottom side, seen from below]

Size 72 x 56 mm. Coordinates in mm from the lower left corner, seen from the top.
Outline: 0,3.85 arc90 3.6,0 68.4,0 arc90 72,3.6 72,52.4 arc90 68.4,56 3.6,56 arc90 0,52.65 0,3.85
Copper layers (1*2*15*16): Top 0.035mm / dielectric 0.2mm / Route2 0.0175mm / dielectric 0.3mm / Route15 0.0175mm / dielectric 0.2mm / Bottom 0.035mm
Design rules "SeeedStudio_4layer_DRU_no_angle_20140221": minimum track width 8mil, minimum drill 12mil, track to track 8mil, track to pad 8mil, pad to pad 8mil, via to via 8mil, smd to smd 0mil, copper to edge 10mil, drill to drill 8mil, minimum pad ring 6mil, minimum via ring 4mil, stop-mask expansion 4mil, vias tented up to drill 25mil, thermal gap 10mil

### Footprints (pad centres in the part's own frame; a part is rotated, then mirrored left to right if it is on the bottom)
C0402 = smd 0.7 x 0.9: 1 -0.65,0; 2 0.65,0
C0805 = smd 1.3 x 1.5: 1 -0.95,0; 2 0.95,0
C0603 = smd 1.1 x 1: 1 -0.85,0; 2 0.85,0
153CLV-0405 = smd 2.6 x 1.6: + 1.8,0; - -1.8,0
C1206 = smd 1.6 x 1.8: 1 -1.4,0; 2 1.4,0
RJ45 = drill 0.9: 1 4.45,-6.35; 2 3.18,-8.89; 3 1.91,-6.35; 4 0.64,-8.89; 5 -0.63,-6.35; 6 -1.9,-8.89; 7 -3.17,-6.35; 8 -4.44,-8.89 | drill 1.1: 9 6.63,4.9; 10 4.09,4.9; 11 -4.09,4.9; 12 -6.63,4.9 | hole 3.2: 5.715,0; -5.715,0 | hole 1.7: -7.75,-3.05; 7.75,-3.05
1812 = smd 1.55 x 3.3: 1 -2.185,0; 2 2.185,0
L5650M = smd 1.8 x 4: 1 -2.5,0; 2 2.5,0
2,8-PAD = drill 2.8 pad 5.334: B2,8 0,0
DIP_3PIN = drill 1.016 long: GND 0,-2.54; IN -2.54,-2.54; OUT 2.54,-2.54
QFN64-9X9 = smd 0.55 x 0.25: 1 -4.477,3.75; 2 -4.477,3.25; 3 -4.477,2.75; 4 -4.477,2.25; 5 -4.477,1.75; 6 -4.477,1.25; 7 -4.477,0.75; 8 -4.477,0.25; 9 -4.477,-0.25; 10 -4.477,-0.75; 11 -4.477,-1.25; 12 -4.477,-1.75; 13 -4.477,-2.25; 14 -4.477,-2.75; 15 -4.477,-3.25; 16 -4.477,-3.75; 33 4.477,-3.75; 34 4.477,-3.25; 35 4.477,-2.75; 36 4.477,-2.25; 37 4.477,-1.75; 38 4.477,-1.25; 39 4.477,-0.75; 40 4.477,-0.25; 41 4.477,0.25; 42 4.477,0.75; 43 4.477,1.25; 44 4.477,1.75; 45 4.477,2.25; 46 4.477,2.75; 47 4.477,3.25; 48 4.477,3.75 | smd 0.25 x 0.55: 17 -3.75,-4.477; 18 -3.25,-4.477; 19 -2.75,-4.477; 20 -2.25,-4.477; 21 -1.75,-4.477; 22 -1.25,-4.477; 23 -0.75,-4.477; 24 -0.25,-4.477; 25 0.25,-4.477; 26 0.75,-4.477; 27 1.25,-4.477; 28 1.75,-4.477; 29 2.25,-4.477; 30 2.75,-4.477; 31 3.25,-4.477; 32 3.75,-4.477; 49 3.75,4.477; 50 3.25,4.477; 51 2.75,4.477; 52 2.25,4.477; 53 1.75,4.477; 54 1.25,4.477; 55 0.75,4.477; 56 0.25,4.477; 57 -0.25,4.477; 58 -0.75,4.477; 59 -1.25,4.477; 60 -1.75,4.477; 61 -2.25,4.477; 62 -2.75,4.477; 63 -3.25,4.477; 64 -3.75,4.477 | smd 7.1 x 7.1: EXP 0,0
2X04 = drill 1.016 octagon: 1 -3.81,-1.27; 2 -3.81,1.27; 3 -1.27,-1.27; 4 -1.27,1.27; 5 1.27,-1.27; 6 1.27,1.27; 7 3.81,-1.27; 8 3.81,1.27
2X03 = drill 1.016 octagon: 1 -2.54,-1.27; 2 -2.54,1.27; 3 0,-1.27; 4 0,1.27; 5 2.54,-1.27; 6 2.54,1.27
1X02 = drill 1.016 octagon: 1 -1.27,0; 2 1.27,0
61400416021 = drill 0.92: 1 -3.5,2.7; 2 -1,2.7; 3 1,2.7; 4 3.5,2.7 | drill 2.3: 5 -6.57,0; 6 6.57,0
BOURNS-SRN4018 = smd 1.5 x 3.5: P$1 -1.525,0; P$2 1.525,0
SRP1250A = smd 5 x 3: 1 0,5.5; 2 0,-5.5
CHIP-LED0603 = smd 0.8 x 0.8: A 0,-0.75; C 0,0.75
RPI_COMPUTE = smd 0.35 x 2: 1 -31.38,-4.1; 2 -31.08,4.1; 3 -30.78,-4.1; 4 -30.48,4.1; 5 -30.18,-4.1; 6 -29.88,4.1; 7 -29.58,-4.1; 8 -29.28,4.1; 9 -28.98,-4.1; 10 -28.68,4.1; 11 -28.38,-4.1; 12 -28.08,4.1; 13 -27.78,-4.1; 14 -27.48,4.1; 15 -27.18,-4.1; 16 -26.88,4.1; 17 -26.58,-4.1; 18 -26.28,4.1; 19 -25.98,-4.1; 20 -25.68,4.1; 21 -25.38,-4.1; 22 -25.08,4.1; 23 -24.78,-4.1; 24 -24.48,4.1; 25 -24.18,-4.1; 26 -23.88,4.1; 27 -23.58,-4.1; 28 -23.28,4.1; 29 -22.98,-4.1; 30 -22.68,4.1; 31 -22.38,-4.1; 32 -22.08,4.1; 33 -21.78,-4.1; 34 -21.48,4.1; 35 -21.18,-4.1; 36 -20.88,4.1; 37 -20.58,-4.1; 38 -20.28,4.1; 39 -19.98,-4.1; 40 -19.68,4.1; 41 -15.78,-4.1; 42 -15.48,4.1; 43 -15.18,-4.1; 44 -14.88,4.1; 45 -14.58,-4.1; 46 -14.28,4.1; 47 -13.98,-4.1; 48 -13.68,4.1; 49 -13.38,-4.1; 50 -13.08,4.1; 51 -12.78,-4.1; 52 -12.48,4.1; 53 -12.18,-4.1; 54 -11.88,4.1; 55 -11.58,-4.1; 56 -11.28,4.1; 57 -10.98,-4.1; 58 -10.68,4.1; 59 -10.38,-4.1; 60 -10.08,4.1; 61 -9.78,-4.1; 62 -9.48,4.1; 63 -9.18,-4.1; 64 -8.88,4.1; 65 -8.58,-4.1; 66 -8.28,4.1; 67 -7.98,-4.1; 68 -7.68,4.1; 69 -7.38,-4.1; 70 -7.08,4.1; 71 -6.78,-4.1; 72 -6.48,4.1; 73 -6.18,-4.1; 74 -5.88,4.1; 75 -5.58,-4.1; 76 -5.28,4.1; 77 -4.98,-4.1; 78 -4.68,4.1; 79 -4.38,-4.1; 80 -4.08,4.1; 81 -3.78,-4.1; 82 -3.48,4.1; 83 -3.18,-4.1; 84 -2.88,4.1; 85 -2.58,-4.1; 86 -2.28,4.1; 87 -1.98,-4.1; 88 -1.68,4.1; 89 -1.38,-4.1; 90 -1.08,4.1; 91 -0.78,-4.1; 92 -0.48,4.1; 93 -0.18,-4.1; 94 0.12,4.1; 95 0.42,-4.1; 96 0.72,4.1; 97 1.02,-4.1; 98 1.32,4.1; 99 1.62,-4.1; 100 1.92,4.1; 101 2.22,-4.1; 102 2.52,4.1; 103 2.82,-4.1; 104 3.12,4.1; 105 3.42,-4.1; 106 3.72,4.1; 107 4.02,-4.1; 108 4.32,4.1; 109 4.62,-4.1; 110 4.92,4.1; 111 5.22,-4.1; 112 5.52,4.1; 113 5.82,-4.1; 114 6.12,4.1; 115 6.42,-4.1; 116 6.72,4.1; 117 7.02,-4.1; 118 7.32,4.1; 119 7.62,-4.1; 120 7.92,4.1; 121 8.22,-4.1; 122 8.52,4.1; 123 8.82,-4.1; 124 9.12,4.1; 125 9.42,-4.1; 126 9.72,4.1; 127 10.02,-4.1; 128 10.32,4.1; 129 10.62,-4.1; 130 10.92,4.1; 131 11.22,-4.1; 132 11.52,4.1; 133 11.82,-4.1; 134 12.12,4.1; 135 12.42,-4.1; 136 12.72,4.1; 137 13.02,-4.1; 138 13.32,4.1; 139 13.62,-4.1; 140 13.92,4.1; 141 14.22,-4.1; 142 14.52,4.1; 143 14.82,-4.1; 144 15.12,4.1; 145 15.42,-4.1; 146 15.72,4.1; 147 16.02,-4.1; 148 16.32,4.1; 149 16.62,-4.1; 150 16.92,4.1; 151 17.22,-4.1; 152 17.52,4.1; 153 17.82,-4.1; 154 18.12,4.1; 155 18.42,-4.1; 156 18.72,4.1; 157 19.02,-4.1; 158 19.32,4.1; 159 19.62,-4.1; 160 19.92,4.1; 161 20.22,-4.1; 162 20.52,4.1; 163 20.82,-4.1; 164 21.12,4.1; 165 21.42,-4.1; 166 21.72,4.1; 167 22.02,-4.1; 168 22.32,4.1; 169 22.62,-4.1; 170 22.92,4.1; 171 23.22,-4.1; 172 23.52,4.1; 173 23.82,-4.1; 174 24.12,4.1; 175 24.42,-4.1; 176 24.72,4.1; 177 25.02,-4.1; 178 25.32,4.1; 179 25.62,-4.1; 180 25.92,4.1; 181 26.22,-4.1; 182 26.52,4.1; 183 26.82,-4.1; 184 27.12,4.1; 185 27.42,-4.1; 186 27.72,4.1; 187 28.02,-4.1; 188 28.32,4.1; 189 28.62,-4.1; 190 28.92,4.1; 191 29.22,-4.1; 192 29.52,4.1; 193 29.82,-4.1; 194 30.12,4.1; 195 30.42,-4.1; 196 30.72,4.1; 197 31.02,-4.1; 198 31.32,4.1; 199 31.62,-4.1; 200 31.92,4.1 | smd 4.5 x 4.6: M1 -32.28,12; M2 32.82,12 | hole 1.6: -33.13,0 | hole 1.1: 33.67,0
CTS_32X25 = smd 1.2 x 0.9: 1 -1.1,-0.7; 2 1.1,-0.7; 3 1.1,0.8; 4 -1.1,0.8
R0402 = smd 0.7 x 0.9: 1 -0.65,0; 2 0.65,0
R0805 = smd 1.3 x 1.5: 1 -0.95,0; 2 0.95,0
R0603 = smd 1 x 1.1: 1 -0.85,0; 2 0.85,0
RPI_CAMERA = smd 0.61 x 2.007: 1 6.985,2.743; 2 5.994,2.743; 3 5.004,2.743; 4 3.988,2.743; 5 2.997,2.743; 6 1.981,2.743; 7 0.991,2.743; 8 0,2.743; 9 -1.016,2.743; 10 -2.007,2.743; 11 -2.997,2.743; 12 -4.013,2.743; 13 -5.004,2.743; 14 -6.02,2.743; 15 -7.01,2.743 | smd 0.711 x 4.191: 17 -8.001,4.877; 18 7.976,4.877
SOT523 = smd 1.118 x 0.457: 1 -0.965,0.66; 2 -0.965,-0.66; 3 0.965,0
WDFN3X3-12L = smd 0.25 x 1: 1 -1.125,-1.7; 2 -0.675,-1.7; 3 -0.225,-1.7; 4 0.225,-1.7; 5 0.675,-1.7; 6 1.125,-1.7; 7 1.125,1.7; 8 0.675,1.7; 9 0.225,1.7; 10 -0.225,1.7; 11 -0.675,1.7; 12 -1.125,1.7 | smd 2.5 x 1.7: PAD 0,0
282836-2 = drill 1.2 pad 2.184 square: CON1 -2.46,0; CON2 2.54,0

### Placement (x,y rotation side)
C1  17.78,44.07 180 bottom
C2  13.46,52.2 0 bottom
C3  13.72,46.1 180 bottom
C4  3.81,48.13 270 bottom
C5  19.18,48.9 90 bottom
C6  13.46,54.23 0 bottom
C7  13.72,44.07 180 bottom
C8  52.45,29.46 270 bottom
C9  48.39,29.46 270 bottom
C10  36.32,38.73 270 bottom
C11  48.81,31.37 180 top
C12  13.34,16.76 0 top
C13  13.46,19.05 0 top
C14  13.46,21.34 0 top
C15  48.82,26.29 180 top
C16  60.36,41.91 90 top
C17  56.13,25.78 180 top
C21  53.59,41.66 90 bottom
C22  51.69,41.66 90 bottom
C23  49.78,41.66 90 bottom
C24  45.72,41.66 90 bottom
C26  47.75,41.66 90 bottom
C27  3.43,41.15 180 top
C28  3.43,39.12 180 top
C29  3.43,37.08 180 top
C30  15.49,44.83 270 top
C31  13.34,44.83 270 top
C32  13.72,26.92 90 bottom
C33  21.34,35.71 0 bottom
C34  21.34,37.72 0 bottom
C35  21.34,39.75 0 bottom
C36  3.81,25.27 90 top
C37  7.75,25.27 90 top
C38  11.68,26.92 90 bottom
C39  18.16,49.02 270 top
C40  16.26,49.02 270 top
C41  20.32,49.15 270 top
C42  25.15,34.8 270 bottom
C43  3.43,33.02 0 top
C44  17.78,27.43 90 bottom
C45  24.38,27.43 90 bottom
ETHERNET  49.15,45.09 0 top
F1  56.57,30.66 270 top
FB1  68.07,18.8 90 top
FB2  3.17,28.98 0 top
FB3  3.17,30.99 0 top
FB4  61.98,18.8 90 top
H1  7.1,3.6 0 top
H2  64.9,3.6 0 top
H3  64.9,52.4 0 top
H4  7.1,52.4 0 top
IC1  40.26,28.83 90 top
IC6  12.7,36.45 180 top
JP1  8.38,10.29 0 top
JP2  58.8,9.78 90 top
JP3  29.59,28.83 0 top
JP4  2.92,45.47 0 top
K1  32.89,45.72 180 top
L1  18.8,52.96 270 bottom
L2  8.64,45.59 90 bottom
L3  65.41,32.89 180 top
LED1  5.84,20.45 270 top
LED2  5.84,16.76 270 top
LOGO1  [OHMYDIGIFAB_LOGO]  42.8,12.7 0 top
PCB1  36.32,18.8 0 bottom
Q6  20.95,27.43 0 bottom
R1  17.78,45.59 0 bottom
R2  5.08,48.13 270 bottom
R3  17.91,48.9 90 bottom
R4  20.45,48.9 270 bottom
R5  2.54,48.13 90 bottom
R6  2.92,20.45 0 top
R7  5.08,26.29 90 bottom
R8  7.11,26.29 90 bottom
R9  9.14,26.29 90 bottom
R10  21.34,33.71 0 bottom
R11  38.79,27.94 90 bottom
R12  40.21,27.94 90 bottom
R13  53.21,2.29 270 bottom
R14  54.36,2.29 270 bottom
R15  2.92,16.76 0 top
R16  29.08,2.29 270 bottom
R17  27.81,2.29 270 bottom
R18  59.18,25.78 180 top
R19  21.84,30.73 90 bottom
R20  9.14,44.83 270 top
R25  42.42,53.21 270 bottom
R26  55.75,53.21 270 bottom
R27  48.39,32.89 90 bottom
R28  46.35,32.89 90 bottom
R29  50.42,32.89 90 bottom
R30  52.45,32.89 90 bottom
R31  54.48,32.89 90 bottom
R32  3.43,35.05 180 top
R33  5.78,25.27 270 top
U1  48.51,8.26 180 top
U2  23.24,8.26 180 top
U3  5.61,14.85 0 top
U5  13.72,48.9 90 bottom
U$1  66.67,11.05 0 top
U$2  67.06,44.7 180 top
U$3  [TENDA_P200]  61.34,5.97 90 top

### Tracks (layer width: path | path; a pad name or v marks a point on that pad's centre or on a via)
3V3A
  Bottom 0.203: C8.1 R30.1
  Bottom 0.254: R28.1 R27.1 | R27.1 R29.1 R30.1 R31.1 | R27.1 C9.1
3V3A1  (via drill 0.3)
  Top 0.203: IC6.10 18.15,37.2 v18.28,36.95 | IC6.5 18.13,34.7 v18.28,34.92 | IC6.54 11.45,29.23 11.45,29.19 v11.68,28.57 | IC6.57 12.95,29.97 v13.72,28.96 | IC6.49 8.95,31.68 7.24,29.97 7.24,28.57 6.1,27.43 3.56,27.43 | C36.2 3.81,27.18 3.56,27.43 | IC6.51 9.95,30.78 v9.53,30.35 8.51,29.34 8.51,27.56 7.75,26.8 C37.2 | FB2.1 2.23,27.62 v2.41,27.43 3.56,27.43 | IC6.64 18.25,31.97 18.28,32 18.28,32.03 v18.27,32.01
  Route2 0.203: v18.28,36.95 v18.28,34.92 18.28,32 18.27,31.99 v18.27,32.01 18.29,32 18.29,31.24 17.65,30.61 15.37,30.61 v13.72,28.96 13.34,28.57 v11.68,28.57 10.03,30.35 v9.53,30.35 6.6,27.43 v2.41,27.43
  Bottom 0.203: C32.2 v13.72,28.96 | v18.28,36.95 18.67,36.95 19.05,37.34 19.05,38.73 20.07,39.75 C35.2 | v18.28,34.92 18.67,34.92 19.05,35.31 19.05,36.2 20.49,37.63 C34.2 | v11.68,28.57 C38.2 | C33.2 20.47,35.71 18.27,33.51 v18.27,32.01
+1V8  (via drill 0.3, 0.4, 0.5)
  Route15 0.203: 6.5,44.06 6.24,44.06 v6.48,44.07
  Route15 0.813: v6.48,44.07 3.56,41.15 3.56,32.26 5.21,30.61 v6.48,30.61 | 6.5,44.06 19.42,44.06 v19.94,44.58
  Bottom 0.254: R3.1 C5.1 19.18,47.5 19.94,46.74 v19.94,44.58 | C7.1 12.7,44
  Bottom 0.406: L2.P$1 C7.1 | v6.48,30.61 7.87,30.61 9.14,29.34 R9.2
  Bottom 0.813: L2.P$1 7.88,44.07 v6.48,44.07
+3V3  (via drill 0.3, 0.3 pad 0.3, 0.4, 0.6)
  Top 0.203: 15.45,43.81 C30.2 | IC6.11 18.14,37.7 v18.29,37.85 | C31.2 11.98,43.98 11.68,43.69 v11.68,42.8 11.45,42.56 IC6.27 | R20.2 v9.14,42.8 | 15.45,43.81 15.46,43.93 | R32.2 2.54,35.01 2.54,34.42 2.92,34.04 6.99,34.04 7.11,34.04 v7.37,33.78 7.45,33.7 IC6.46 | C28.1 4.28,38.77 4.36,38.77 4.7,39.12 5.21,39.12 v5.84,38.48 5.84,37.47 6.11,37.2 IC6.39 | FB2.2 6.12,28.98 v6.48,29.34 | C27.1 7.24,41.15 v7.37,41.02 8.19,40.2 IC6.33 | IC6.40 v5.85,36.7 v5.84,36.7 5.46,37.08 C29.1 | 15.45,43.81 15.45,43.1 v15.46,42.8 15.45,43.01 IC6.19
  Top 0.254: v55.37,1.52 55.52,1.68 U1.15 | U2.15 30.25,1.68 v30.1,1.52 | R6.1 v1.04,20.45 | R15.1 v1.04,16.76
  Route2 0.203: v6.48,29.34 7.37,30.23 v7.37,33.78 7.37,35.18 v5.84,36.7 v5.84,38.48 5.84,39.5 v7.37,41.02 7.37,41.53 8.64,42.8 v9.14,42.8 v11.68,42.8 v15.46,42.8 18.8,42.8 20.19,41.4
  Route2 0.254: 20.19,41.4 20.19,39.75 v18.29,37.85
  Route15 0.406: 1.17,45.59 1.65,45.59 JP4.1
  Route15 0.813: 35.94,1.52 v30.1,1.52 12.19,1.52 10.67,3.05 10.67,5.33 8.89,7.11 3.43,7.11 1.04,9.51 v1.04,16.76 v1.04,20.45 1.04,23.11 | 35.94,1.52 v55.37,1.52 | 1.04,45.47 1.04,49.3 1.91,50.16 v3.43,50.16 5.21,48.39 8.89,48.39 11.18,50.67 11.18,52.96 13.21,54.99 v16,54.99 v21.46,54.99 v40.13,54.99 | 1.04,45.47 1.04,29.34 | 1.04,29.34 1.04,23.11 | v6.48,29.34 1.04,29.34 | 1.04,23.11 28.19,22.99 32.13,26.92 JP3.5 JP3.6 | 1.17,45.59 1.04,45.47 | v55.24,23.24 v52.32,23.24 v52.32,17.53 | v56.01,17.02 55.5,17.53 v52.32,17.53 | v52.32,17.53 45.85,17.53 35.94,7.62 35.94,1.52
  Bottom 0.203: C4.1 3.81,49.78 v3.43,50.16
  Bottom 0.254: v55.37,1.52 54.47,1.52 R14.2 R13.2 | v30.1,1.52 29.99,1.64 R16.2 R17.2 | 14.22,54.55 15.56,54.55 v16,54.99 | R2.1 C4.1 | R26.1 R25.1 41.49,54.99 v40.13,54.99 | PCB1.42 51.91,22.9 v52.32,23.24 | PCB1.40 55.53,22.9 v55.24,23.24 | PCB1.41 52.1,17.3 v52.32,17.53 | PCB1.39 56.3,16.72 v56.01,17.02
  Bottom 0.406: C6.1 14.22,54.55 | R7.2 R8.2 7.11,28.7 v6.48,29.34
  Bottom 0.813: L1.P$1 20.95,54.48 v21.46,54.99
+5V  (via drill 0.3, 0.4)
  Top 0.813: C11.+ IC1.OUT
  Route15 0.813: JP1.1 JP1.2 8.26,15.24 30.99,15.37 35.05,19.43 35.05,25.15 41.27,31.37 | v16,51.94 16,46.86 | 16,46.86 14.73,45.59 v11.43,45.59 | 16,46.86 v18.41,46.86 19.3,46.86 21.08,48.64 33.53,48.64 36.39,45.78 K1.1 36.39,36.25 41.27,31.37 | 43.18,31.37 IC1.OUT 41.27,31.37
  Bottom 0.254: 11.43,50.67 11.43,50.14 11.56,50.01 | 16,50.67 16,50.14 15.88,50.01 U5.7 | U5.1 12.77,47.02 C3.1 | R1.1 18.41,46.12 v18.41,46.86
  Bottom 0.305: 12.83,46.1 C3.1
  Bottom 0.406: v16,51.94 15.75,52.2 C2.1 | 12.83,46.1 12.32,45.59 v11.43,45.59 | C10.1 36.32,42.95 K1.1
  pour Bottom: 16.51,52.96 13.72,52.96 13.72,51.18 11.43,51.18 11.43,50.04 16.51,50.04
+12V
  Top 1.016: F1.1 56.57,37.13 57.91,38.48 64.94,38.48 L3.2
  pour Top: 59.18,41.66 59.18,35.56 72.01,35.56 72.01,48.26 67.18,48.26 67.18,41.66
AGND
  Route2 0.406: U$1.CON1 63.2,12.32 JP2.5 JP2.6
  pour Top: 61.21,13.34 61.21,8.76 66.42,8.76 66.42,13.46 64.77,15.11 64.77,18.16 59.18,18.16 59.18,13.97 60.58,13.97
AVCC
  Route2 0.406: U$1.CON2 65.15,7.24 JP2.1 JP2.2
  pour Top: 66.93,13.72 66.93,8.76 72.01,8.76 72.01,18.16 65.28,18.16 65.28,15.37
CAM0_C_N  (via drill 0.3)
  Top 0.254: U1.8 48.51,7.62 48.77,7.87 48.77,9.8 45.87,12.7 30.12,12.7 28.7,14.12 28.7,16.76 v28.53,16.76
  Bottom 0.254: v28.53,16.76 28.7,16.76 28.7,17.8 27.58,18.93 22.25,18.93 21.25,19.92 21.25,21.65 21.2,21.7 PCB1.144
CAM0_C_P  (via drill 0.3)
  Top 0.254: U1.9 49.53,7.62 49.27,7.87 49.27,10.01 46.08,13.21 30.33,13.21 29.21,14.33 29.21,16.76 v29.38,16.76
  Bottom 0.254: v29.38,16.76 29.21,16.76 29.21,18.01 27.79,19.43 22.46,19.43 21.75,20.13 21.75,21.65 21.8,21.7 PCB1.142
CAM0_D0_N  (via drill 0.3)
  Top 0.254: U1.2 42.52,7.59 42.8,7.87 42.8,8.66 41.81,9.65 27.2,9.65 24.89,11.96 24.89,17.38 25.93,18.41 29.23,18.41 29.79,18.97 v29.7,19.06
  Bottom 0.254: v29.7,19.06 29.79,18.97 29.97,19.15 29.97,19.58 29.11,20.45 23.64,20.45 23.04,21.05 23.04,21.65 23,21.69 PCB1.138
CAM0_D0_P  (via drill 0.3)
  Top 0.254: U1.3 43.51,7.67 43.3,7.87 43.3,8.87 42.01,10.16 27.41,10.16 25.4,12.17 25.4,17.17 26.14,17.91 29.44,17.91 30.15,18.62 v30.24,18.53
  Bottom 0.254: v30.24,18.53 30.15,18.62 30.48,18.95 30.48,19.79 29.31,20.95 23.86,20.95 23.54,21.27 23.54,21.65 23.6,21.71 PCB1.136
CAM0_D1_N  (via drill 0.3)
  Top 0.254: U1.5 45.52,7.62 45.77,7.87 45.77,8.99 43.58,11.18 28.6,11.18 26.93,12.85 26.93,16.76 v26.75,16.76
  Bottom 0.254: v26.75,16.76 26.93,16.76 26.93,17.17 26.57,17.53 20.98,17.53 19.45,19.06 19.45,21.63 19.4,21.67 PCB1.150
CAM0_D1_P  (via drill 0.3)
  Top 0.254: U1.6 46.53,7.62 46.28,7.87 46.28,9.2 43.79,11.68 28.81,11.68 27.43,13.06 27.43,16.76 v27.6,16.76
  Bottom 0.254: v27.6,16.76 27.43,16.76 27.43,17.38 26.77,18.03 21.19,18.03 19.95,19.27 19.95,21.63 20,21.68 PCB1.148
CAM0_IO0  (via drill 0.3)
  Top 0.254: U1.11 v51.51,11
  Bottom 0.254: PCB1.36 57.2,21.52 52.91,17.22 52.91,13.54 51.51,12.14 v51.51,11
CAM0_IO1  (via drill 0.3)
  Top 0.254: U1.12 v52.53,11
  Bottom 0.254: PCB1.34 57.8,21.35 53.47,17.02 53.47,13.06 52.53,12.12 v52.53,11
CAM0_SCL  (via drill 0.3)
  Top 0.254: v53.52,11 U1.13 53.52,4.52 v53.21,4.19
  Bottom 0.254: PCB1.30 59,21.79 54,16.79 54,12.55 53.52,12.06 v53.52,11 | R13.1 v53.21,4.19
CAM0_SDA  (via drill 0.3)
  Top 0.254: v54.53,11 U1.14 54.53,4.52 v54.36,4.32
  Bottom 0.254: PCB1.28 59.6,21.63 54.53,16.56 v54.53,11 | R14.1 v54.36,4.32
CAM1_C_N  (via drill 0.3)
  Top 0.254: U2.8 23.24,7.57 23.5,7.82 23.5,8.13 v23.32,8.13
  Bottom 0.254: v23.32,8.13 23.5,8.13 23.5,8.66 19.74,12.42 19.74,13.36 19.7,13.4 PCB1.149
CAM1_C_P  (via drill 0.3)
  Top 0.254: U2.9 24.26,7.57 24,7.82 24,8.13 v24.17,8.13
  Bottom 0.254: v24.17,8.13 24,8.13 24,8.87 20.24,12.63 20.24,13.36 20.3,13.42 PCB1.147
CAM1_D0_N  (via drill 0.3)
  Top 0.254: U2.2 17.25,7.52 17.5,7.77 17.5,8.13 v17.33,8.13
  Bottom 0.254: v17.33,8.13 17.5,8.13 17.5,8.56 16.16,9.9 16.16,13.34 16.1,13.39 PCB1.161
CAM1_D0_P  (via drill 0.3)
  Top 0.254: U2.3 18.24,7.54 18.01,7.77 18.01,8.13 v18.18,8.13
  Bottom 0.254: v18.18,8.13 18.01,8.13 18.01,8.77 16.66,10.11 16.66,13.34 16.7,13.38 PCB1.159
CAM1_D1_N  (via drill 0.3)
  Top 0.254: U2.5 20.24,7.59 20.5,7.85 20.5,8.13 v20.33,8.13
  Bottom 0.254: v20.33,8.13 20.5,8.13 20.5,8.61 17.93,11.17 17.93,13.36 17.9,13.39 PCB1.155
CAM1_D1_P  (via drill 0.3)
  Top 0.254: U2.6 21.26,7.59 21,7.85 21,8.13 v21.18,8.13
  Bottom 0.254: v21.18,8.13 21,8.13 21,8.82 18.44,11.38 18.44,13.36 18.5,13.42 PCB1.153
CAM1_IO0  (via drill 0.3)
  Top 0.254: 26.16,6.35 U2.11 v26.24,8.08
  Bottom 0.254: v26.24,8.08 26.24,9.47 26.92,10.16 55.12,10.16 56.01,11.05 61.21,11.05 61.72,11.56 61.72,12.83 62.23,13.34 64.52,13.34 64.7,13.52 PCB1.11
CAM1_IO1  (via drill 0.3)
  Top 0.254: v27.25,8.08 U2.12
  Bottom 0.254: v27.25,8.08 27.25,8.94 27.96,9.65 54.99,9.65 56.13,8.51 61.47,8.51 62.36,9.4 62.36,12.45 62.74,12.83 64.77,12.83 65.3,13.36 PCB1.9
CAM1_SCL  (via drill 0.3)
  Top 0.254: U2.13 28.19,6.33 | v28.25,8.08 U2.13 | v27.81,3.94 28.25,4.37 U2.13
  Bottom 0.254: v28.25,8.08 28.25,8.76 28.63,9.14 52.58,9.14 56.13,5.59 60.71,5.59 63.12,8 65.15,8 66.5,9.35 PCB1.5 | R17.1 v27.81,3.94
CAM1_SDA  (via drill 0.3)
  Top 0.254: U2.14 29.21,6.33 | v29.26,8.08 U2.14 | v29.08,3.94 29.26,4.14 U2.14
  Bottom 0.254: v29.26,8.08 29.26,8.31 29.59,8.64 52.32,8.64 56.01,4.95 60.96,4.95 63.37,7.37 65.41,7.37 67.1,9.06 PCB1.3 | R16.1 v29.08,3.94
CM_1V8  (via drill 0.3)
  Top 0.254: C12.1 v9.5,16.76
  Bottom 0.406: PCB1.185 PCB1.183 v9.5,16.76 9.5,20.22 9.2,20.52 PCB1.184 | PCB1.184 PCB1.186 | PCB1.184 9.2,25.91 R9.1
CM_3V3  (via drill 0.3)
  Top 0.254: C13.1 v7.1,19.05
  Bottom 0.406: PCB1.193 PCB1.191 | PCB1.191 v7.1,19.05 7.1,19.57 7.06,19.61 6.8,19.88 PCB1.192 | PCB1.192 PCB1.190 7.4,25.68 R8.1 | PCB1.194 PCB1.192 | PCB1.191 PCB1.189
CM_VBAT  (via drill 0.3)
  Top 0.254: C14.1 v5,21.34
  Bottom 0.406: PCB1.200 PCB1.198 | PCB1.198 v5,21.34 5,19 5.3,18.7 PCB1.197 PCB1.199 4.06,14.69 | PCB1.198 5,25.9 R7.1
EXT0/UART1_TX  (via drill 0.3)
  Top 0.254: JP1.6 11.94,13.84 16,13.84 24.26,22.1 30.73,22.1 35.69,17.14 42.42,17.14 43.41,18.14 43.41,18.67 v43.52,18.67
  Bottom 0.254: PCB1.70 43.4,18.67 v43.52,18.67
EXT1/UART1_RX  (via drill 0.3)
  Top 0.254: v42.67,18.67 42.8,18.67 42.8,18.29 42.16,17.65 36.07,17.65 30.99,22.73 24.13,22.73 15.75,14.35 9.91,14.35 JP1.4
  Bottom 0.254: 42.8,18.67 v42.67,18.67 42.8,18.67 | 42.8,18.67 PCB1.72
GND  (via drill 0.3, 0.6)
  Top 0.254: IC6.44 11.59,34.7 11.68,34.8 11.68,35.43 IC6.EXP 12.32,36.83 12.32,38.35 10.97,39.7 IC6.34
  Bottom 0.254: 56.64,23.5 56.6,23.96 56.6,24.29 PCB1.38 56.62,23.8 56.62,25.04 | 56.62,25.04 56.39,25.02 | PCB1.32 58.4,24.75 58.29,25.02 56.59,25.02 56.62,25.04 | 51.05,25.02 51.08,24.99 51.21,24.93 PCB1.44 51.2,22.91 51.21,22.78 51.21,22.12 51.18,22.1 | 56.77,17.14 56.78,17.13 56.78,16.83 56.9,16.57 PCB1.37 | 49.66,13.84 49.71,14.17 49.71,14.82 49.7,14.82 PCB1.49 | 51.56,13.84 51.5,14.03 51.5,15.2 | 51.31,16.89 51.51,16.82 51.51,15.54 51.5,15.2 | 51.5,15.2 51.5,15.45 PCB1.43 | 13.93,49.11 15.41,49.11 U5.9 16.36,49.12 arc90 16.38,49.15 | 13.93,49.11 U5.PAD 13.46,48.64 13.34,48.64 13.3,48.68 U5.3 | 20.45,25.4 20.47,25.38 20.6,25.18 PCB1.146 | 22.24,25.45 22.4,25.29 22.4,23.53 PCB1.140 | 24.13,25.27 24.19,25.21 24.19,23.67 PCB1.134 | 18.54,25.15 18.8,24.77 18.8,23.66 | 18.8,23.66 PCB1.152 | 18.8,22.48 18.8,23.66 | 17.14,17.4 17.31,17.23 17.31,15.47 PCB1.157 | 19.05,17.14 19.1,17.07 19.1,15.46 PCB1.151 | 15.11,12.83 15.51,13.22 15.51,14.67 15.5,14.55 PCB1.163 15.5,15.15 15.49,15.15 15.49,17.14 | 20.7,16.76 20.9,16.59 20.9,15.57 20.9,15.46 | 20.95,13.97 20.9,14.02 20.9,15.32 | 20.9,15.46 20.9,15.37 | 20.9,15.37 PCB1.145 | 20.9,15.32 20.9,15.46 | 13.34,16.89 13.7,16.52 13.7,15.33 | 13.72,15.33 13.72,13.84 | 13.7,15.33 PCB1.169 | 13.93,49.11 13.72,49.33 v13.72,49.66 | 13.7,15.33 13.72,15.33 | 13.72,15.33 13.72,15.37 | 20.9,15.32 20.9,15.37 | 20.9,15.37
  other vias: 8.13,20.32 13.72,48.13 10.03,39.12 11.81,39.12 13.59,39.12 15.37,39.12 10.03,37.34 10.03,35.56 10.03,33.78 11.81,37.34 11.81,35.56 11.81,33.78 13.59,37.34 15.37,37.34 13.59,35.56 15.37,35.56 15.37,33.78 13.59,33.78 4.19,55.12 1.91,53.85 1.02,51.31 3.3,51.18 10.03,55.24 10.67,54.23 5.97,46.35 2.92,44.2 2.29,42.16 4.19,43.05 6.6,42.55 5.46,40.51 9.91,42.04 12.45,41.91 17.91,52.96 20.19,53.09 22.1,53.85 24.13,52.45 22.1,50.67 21.46,46.23 19.56,42.93 21.21,44.32 24.13,44.32 24,46.99 26.67,53.98 31.11,54.1 35.43,53.98 40.39,53.59 28.45,51.31 32.64,51.18 40.89,50.67 37.08,51.05 25.53,50.67 31.37,47.24 35.69,48.39 38.86,48.26 34.16,45.09 30.73,44.32 38.35,43.05 34.67,41.66 30.73,41.53 22.35,41.78 27.05,41.91 24.89,39.75 29.08,39.75 24.26,37.21 32,36.83 35.18,35.94 40.39,36.96 38.61,39.37 43.56,42.16 41.53,39.88 46.61,44.2 52.07,44.2 45.85,46.74 49.28,45.47 52.83,47.62 44.32,52.45 49.28,51.82 54.1,52.45 46.61,48.77 50.42,48.9 43.81,54.99 49.4,55.12 54.48,55.12 61.59,55.12 57.28,54.1 60.83,51.82 57.53,50.93 56.01,47.88 57.91,44.32 60.07,47.88 61.59,45.21 65.53,47.37 65.79,42.8 57.4,40.01 68.58,54.48 67.44,49.4 70.74,50.67 35.43,31.5 39.24,31.75 35.31,27.56 37.85,25.65 32.38,25.91 28.7,26.42 25.02,31.62 27.05,36.2 23.24,25.65 44.58,30.1 44.7,27.69 41.15,27.43 40.51,25.4 46.86,29.59 50.55,29.72 54.1,29.97 53.59,26.42 54.36,21.84 50.42,21.21 44.32,21.08 50.16,18.41 44.58,17.78 46.48,19.81 53.34,19.94 57.02,17.78 59.94,19.68 64.39,19.68 55.5,12.57 50.93,12.95 49.78,11.56 1.02,8.26 3.81,6.22 3.3,1.27 1.52,3.56 10.79,1.27 12.95,3.43 12.06,5.84 15.37,8.26 14.73,6.35 16.38,3.56 17.14,2.41 19.3,3.56 22.35,3.43 25.65,3.56 20.7,2.41 23.88,2.41 26.67,2.41 31.37,7.37 32.51,2.67 36.96,5.08 39.88,7.75 34.8,5.08 39.12,2.67 41.78,3.43 44.58,3.56 47.62,3.43 50.8,3.56 43.18,2.41 46.1,2.41 49.15,2.41 52.07,2.92 57.66,3.81 60.71,3.94 57.66,1.14 61.47,1.14 59.44,2.29 67.18,7.11 68.58,1.4 70.99,7.75 70.74,3.43 3.05,15.62 2.41,9.78 2.41,14.22 7.49,13.08 5.84,10.16 13.84,11.43 8.38,17.4 10.41,20.32 10.41,17.91 3.94,18.29 17.53,18.29 21.72,12.95 23.62,12.83 25.27,9.27 23.62,11.3 31.37,17.65 34.04,21.08 36.07,21.08 38.99,21.08 41.66,21.08 36.58,18.67 40.77,18.54 39.37,19.81 2.67,22.1 10.54,26.04 37.21,30.1 25.91,25.53 44.83,25.27 58.04,26.92 57.91,30.73 58.04,36.32 54.86,35.43 44.45,38.23 43.31,35.43 6.22,34.8 23.62,35.81 7.37,38.73 4.95,38.1 5.21,36.07 13.46,20.19 13.34,17.91 1.4,6.35 10.92,7.87 13.46,9.65 10.92,10.92 13.72,48.9 28.7,46.99 60.83,19.68 61.72,19.68 62.61,19.68 63.5,19.68
  pour Top (rank 6): 72,56 72,35.43 58.8,35.43 58.8,30.23 72.01,30.23 72,0 0,0 0,56
  pour Bottom (rank 6): 0.01,56 0.01,0 72.01,0 72.01,30.23 58.8,30.23 58.8,35.43 72,35.43 72,56
  pour Route15 (rank 6): 0.01,56 0.01,0 72.01,0 72.01,30.23 58.8,30.23 58.8,35.43 72,35.43 72,56
  pour Route2 (rank 6): 0.01,56 0.01,0 72.01,0 72.01,30.23 58.8,30.23 58.8,35.43 72,35.43 72,56
GPIO47_1V8  (via drill 0.3)
  Top 0.254: v37.34,21.34 35.31,23.37 23.88,23.37 15.37,14.86 8.51,14.86 7.37,13.72 6.1,13.72 5.65,14.16 5.65,15.18 5.32,15.51 U3.1
  Bottom 0.254: v37.34,21.34 37.4,21.53 PCB1.90
LAN_RUN  (via drill 0.3)
  Top 0.203: IC6.12 17.5,38.2 17.75,38.2 19.3,39.75 v19.3,40.89
  Top 0.254: v58.42,17.65 58.42,18.8 58.17,19.05 45.97,19.05 45.09,19.94 41.53,19.94 v34.42,27.05
  Bottom 0.254: PCB1.21 61.7,16.78 61.09,17.4 58.67,17.4 v58.42,17.65 | v34.42,27.05 34.42,39.75 33.27,40.89 v19.3,40.89
N$1
  Bottom 0.254: U5.12 16.11,47.77 17.13,46.75 C1.1 R1.2
N$2
  Bottom 0.254: L1.P$2 17.27,51.43 16.51,50.67 16.51,49.91 16.17,49.57 U5.8
N$6
  pour Top: 59.18,30.1 59.18,23.5 65.28,23.5 65.28,19.43 72.01,19.43 72.01,30.1
N$7
  Bottom 0.254: L2.P$2 10.67,47.12 10.92,47.37 10.92,47.88 11.26,48.22 U5.2
N$8
  Bottom 0.254: R5.1 C4.2 R2.2 5.32,47.48 6.35,48.51 8.76,48.51 9.37,49.12 U5.4
N$9
  Top 0.406: R6.2 LED1.A
N$10
  Bottom 0.254: 17.92,49.55 C5.2 R4.1 | U5.10 16.65,48.67 17.53,49.55 17.78,49.4 17.92,49.55 | 17.92,49.55 R3.2
N$31
  Bottom 0.254: PCB1.82 39.8,26.96 R12.1
N$32
  Top 0.406: R15.2 LED2.A
N$33
  Top 0.254: LED2.C 6.59,16.13 U3.3
N$34
  Bottom 0.254: R11.1 39.2,26.87 PCB1.84
N$37
  Bottom 0.254: R25.2 42.52,52.26 ETHERNET.12
N$38
  Top 0.254: R18.2 C17.1
N$39
  Top 0.813: IC1.IN C15.+
  Top 1.016: F1.2 47.78,28.47 47.02,27.71 C15.+
N$40
  Bottom 0.254: R26.2 55.78,52.34 ETHERNET.9
N$41
  Bottom 0.254: C26.1 48.52,40.04 ETHERNET.5 49.79,37.47 ETHERNET.4 49.79,35.15 R27.2
N$42  (via drill 0.3)
  Top 0.203: IC6.63 15.95,31.68 16.38,31.24 v17.14,31.24
  Bottom 0.203: v17.14,31.24 18.54,31.24 18.92,31.62 18.92,32.14 R10.2
N$43  (via drill 0.3)
  Top 0.203: FB3.2 5.59,30.99 6.1,31.5 7.62,31.5 v8.13,32 | IC6.62 15.45,31.41 16.26,30.61 v18.67,30.61
  Bottom 0.203: v8.13,32 14.86,32 16.26,30.61 v18.67,30.61 19.05,30.61 19.81,31.37 19.81,31.88 20.57,32.64 23.94,32.64 C42.2
N$44
  Top 0.203: IC6.41 6.48,36.2 5.33,35.05 R32.1
N$45
  Top 0.203: IC6.50 9.45,31.29 7.87,29.72 7.87,28.19 6.1,26.42 5.82,26.16 R33.1
N$46
  Top 0.203: IC6.28 10.95,43.79 10.41,44.32 10.41,45.34 10.07,45.68 R20.1
NLNKA_LED  (via drill 0.3)
  Top 0.254: IC6.21 14.45,41.4 v14.58,41.53
  Bottom 0.254: v14.58,41.53 20.45,41.53 21.84,42.93 27.3,42.93 29.72,45.34 32.64,45.34 34.04,46.74 34.04,48.77 34.54,49.28 40.01,49.28 41.53,47.75 51.01,47.75 ETHERNET.10
NSPD_LED  (via drill 0.3)
  Top 0.254: IC6.22 13.95,41.68 v13.72,41.91
  Bottom 0.254: v13.72,41.91 13.97,42.16 20.19,42.16 21.59,43.56 27.05,43.56 29.46,45.97 32.26,45.97 33.15,46.86 33.15,48.9 34.16,49.91 40.26,49.91 41.66,48.51 43.59,48.51 ETHERNET.11
RX_N
  Top 0.254: ETHERNET.6 47.25,35.69 arc90 47.88,35.05 48.52,35.05 arc-90 49.15,34.42 49.15,34.04 arc-90 48.64,33.53 25.4,33.53 arc90 22.35,30.48 22.35,29.59 arc-90 19.3,26.54 13.34,26.54 arc-90 10.95,28.93 IC6.53
  Bottom 0.254: C24.1 45.81,40.81 47.25,39.37 ETHERNET.6 47.25,34.64 R28.2
RX_P
  Top 0.254: ETHERNET.3 51.06,35.82 arc-90 50.29,35.05 50.29,35.05 arc90 49.66,34.42 49.66,34.04 arc-90 48.64,33.02 25.4,33.02 arc90 22.86,30.48 22.86,29.59 arc-90 19.3,26.04 13.34,26.04 arc-90 10.45,28.92 IC6.52
  Bottom 0.254: R29.2 51.06,34.38 ETHERNET.3 51.06,39.53 C23.1
TX_N
  Top 0.254: ETHERNET.2 53.09,36.2 arc90 55.12,38.1 55.12,38.99 arc90 52.7,41.4 50.93,41.4 arc90 50.93,41.4 45.85,41.4 arc90 42.55,38.1 arc-90 39.37,34.92 25.02,34.92 arc90 20.7,30.61 20.7,29.72 arc-90 19.05,28.07 14.35,28.07 arc-90 12.45,29.97 IC6.56
  Bottom 0.254: R30.2 52.33,33.87 ETHERNET.2 52.33,40.17 C22.1
TX_P
  Top 0.254: ETHERNET.1 arc90 51.44,40.9 45.85,40.9 arc90 43.05,38.1 arc-90 39.37,34.42 25.02,34.42 arc90 21.21,30.61 21.21,29.72 arc-90 19.05,27.56 14.35,27.56 arc-90 11.95,29.96 IC6.55
  Bottom 0.203: C21.1
  Bottom 0.254: C21.1 ETHERNET.1 53.6,34.63 R31.2
UART0_RX  (via drill 0.3)
  Top 0.254: JP1.5 9.65,7.62 10.16,7.11 12.83,7.11 14.22,8.51 14.22,9.27 25.78,20.83 30.23,20.83 34.92,16.13 45.34,16.13 48.39,13.08 v48.26,13.08
  Bottom 0.254: v48.26,13.08 48.5,13.32 PCB1.53
UART0_TX  (via drill 0.3)
  Top 0.254: JP1.3 8.38,10.29 14.35,10.29 25.53,21.46 30.48,21.46 35.31,16.64 45.59,16.64 49.15,13.08 v49.28,13.08
  Bottom 0.254: v49.28,13.08 49.1,13.26 PCB1.51
USB_D_N  (via drill 0.3)
  Top 0.254: IC6.58 13.45,30.3 14.82,28.92 v14.73,28.83 | v15.65,25.27 15.77,25.27 15.77,24.29 16.92,23.15 16.92,21.08 v16.79,21.08
  Bottom 0.254: v14.73,28.83 14.82,28.92 15.77,27.97 15.77,25.27 v15.65,25.27 | v16.79,21.08 16.92,21.08 16.92,20.16 14.38,17.62 14.38,17.14 14.3,17.07 PCB1.167
USB_D_P  (via drill 0.3)
  Top 0.254: IC6.59 13.95,30.44 15.15,29.25 v15.24,29.33 | v16.36,25.27 16.23,25.27 16.23,24.48 17.37,23.34 17.37,21.08 v17.5,21.08
  Bottom 0.254: v15.24,29.33 15.15,29.25 16.23,28.16 16.23,25.27 v16.36,25.27 | v17.5,21.08 17.37,21.08 17.37,19.97 14.83,17.43 14.83,17.14 14.9,17.02 PCB1.165
USBD3_N
  Top 0.254: IC6.3 18.69,33.7 arc90 21.31,36.32 arc-90 23.24,38.25 31.5,38.25 arc90 33.12,39.88 33.12,42.25 arc-90 K1.2
USBD3_P
  Top 0.254: IC6.4 18.73,34.2 arc90 20.85,36.32 arc-90 23.24,38.71 31.5,38.71 arc90 32.66,39.88 32.66,42.25 arc90 K1.3
VDD18CORE  (via drill 0.3)
  Top 0.203: IC6.38 7,37.7 v6.73,37.97
  Top 0.254: C40.2 C39.2 20.32,48.17 | C41.2 20.32,46.86 18.29,44.83 v18.29,40.13 17.86,39.7 IC6.15
  Top 0.406: 20.32,48.17 C41.2
  Bottom 0.203: v6.73,37.97 6.73,39.24 8.38,40.89 17.53,40.89 v18.29,40.13
VDD18PLL  (via drill 0.3)
  Top 0.203: C43.2 6.1,33.02 v6.48,32.64 5.97,32.13 3.37,32.13 FB3.1
  Top 0.254: IC6.48 6.54,32.7 v6.48,32.64
XI  (via drill 0.3)
  Top 0.203: IC6.61 14.95,31.28 16.13,30.1 18.03,30.1 v18.29,29.84
  Bottom 0.203: v18.29,29.84 19.56,29.84 20.57,30.86 20.57,31.37 20.79,31.58 R19.2 22.52,31.58 23.24,30.86 23.24,29.43 C45.2 23.58,28.28 23.24,27.94 23.24,27.18 22.8,26.73 Q6.1
XO  (via drill 0.3)
  Top 0.203: IC6.60 14.45,31.14 16.13,29.46 v17.53,29.46
  Bottom 0.203: 19.8,28.28 C44.2 17.78,29.21 v17.53,29.46 | Q6.3 19.86,28.87 20.87,29.88 R19.1
  Bottom 0.254: 19.8,28.28 Q6.3

### Text on the board
tPlace: VCC | 3V3 | GND | * | OpenBLW | Interface Board | Rev.0.5 | CAM1 | CAM0 | AVCC
bPlace: *